# Altium project OBDH_Ed02.PrjPcb
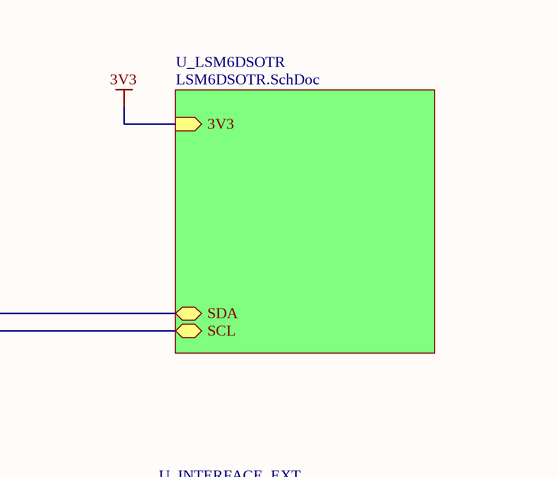
[diagram p0: BLOCO PRINCIPAL.SchDoc, top right]
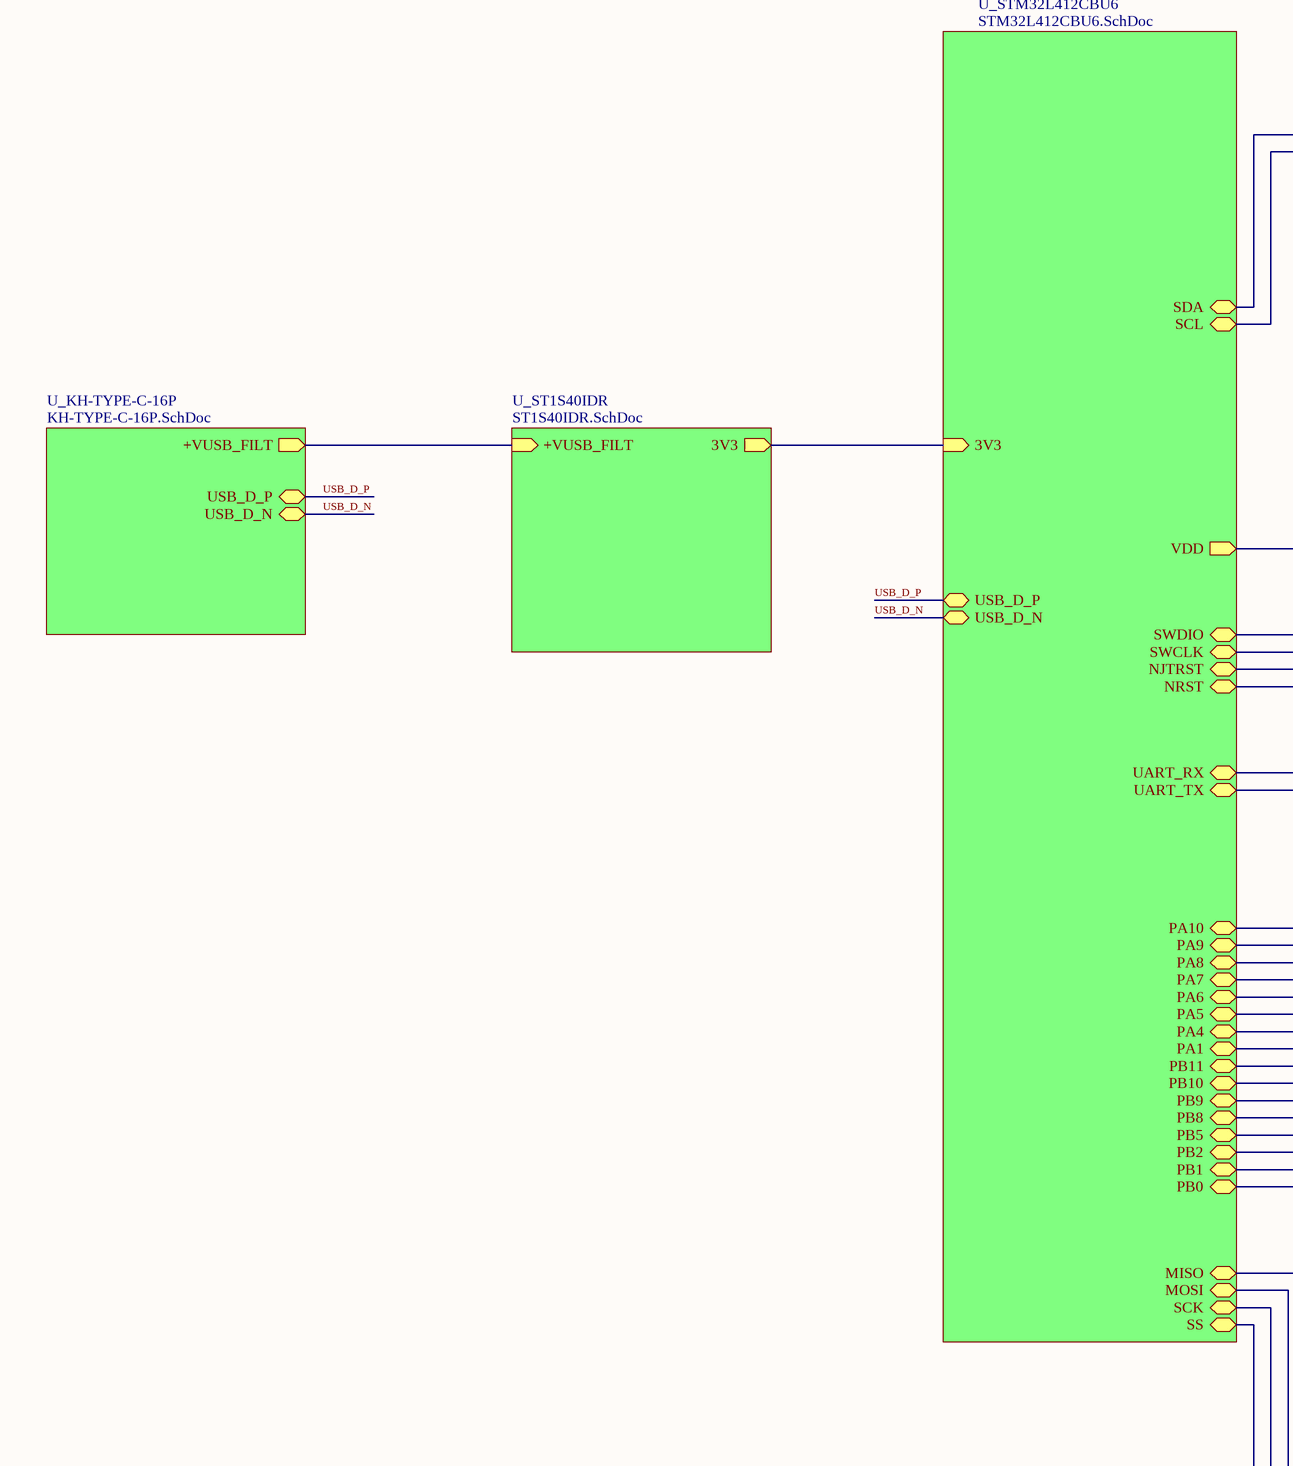
[diagram p1: BLOCO PRINCIPAL.SchDoc, bottom left]
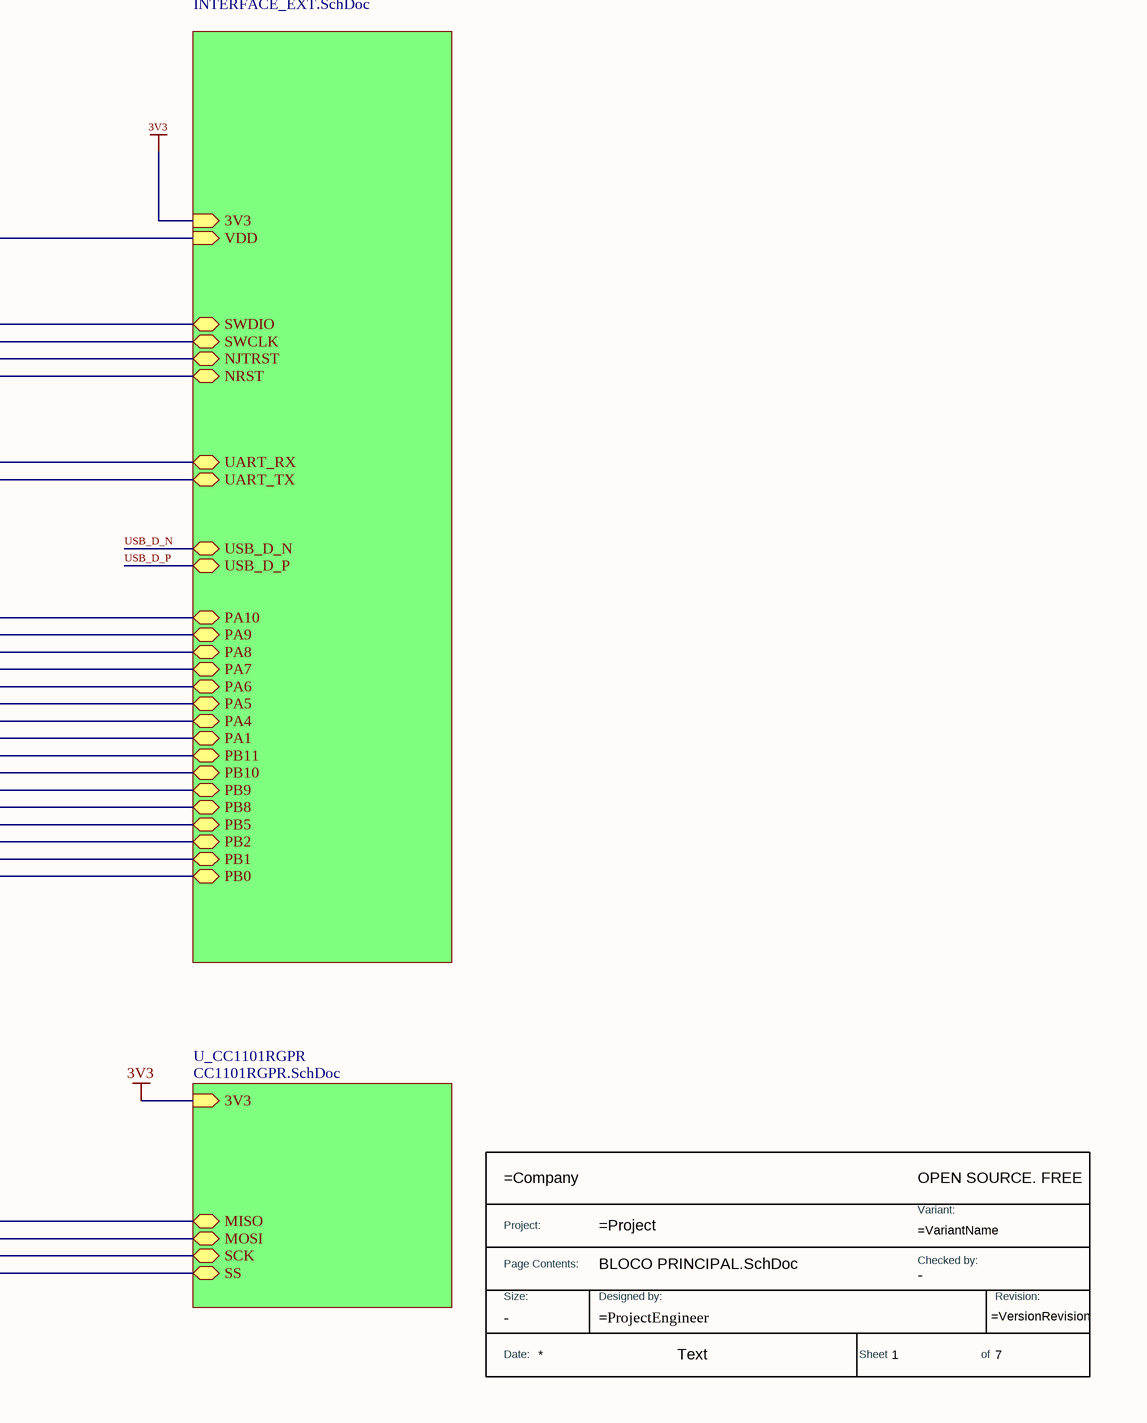
[diagram p2: BLOCO PRINCIPAL.SchDoc, bottom right]
7 sheets, 107 parts. Net scope: hierarchical (ports join the sheet entries above them; power ports are global).
Board file: OBDH_Ed02.PcbDoc
Sheets:
  BLOCO PRINCIPAL.SchDoc
    U_KH-TYPE-C-16P = KH-TYPE-C-16P.SchDoc
    U_STM32L412CBU6 = STM32L412CBU6.SchDoc
    U_ST1S40IDR = ST1S40IDR.SchDoc
    U_CC1101RGPR = CC1101RGPR.SchDoc
    U_LSM6DSOTR = LSM6DSOTR.SchDoc
    U_INTERFACE_EXT = INTERFACE_EXT.SchDoc

## Sheet BLOCO PRINCIPAL.SchDoc
size A3; SheetNumber: 1; SheetTotal: 7

### Parts
(Parts that share a designator on the sheet are numbered #1, #2 ... from top to bottom, then left to right.)
*#1  TitleBlock  (value not drawn)  (graphical)

### Sub-sheets
U_CC1101RGPR = CC1101RGPR.SchDoc: 3V3 (in), MOSI (bidir), MISO (bidir), SCK (bidir), SS (bidir)
U_INTERFACE_EXT = INTERFACE_EXT.SchDoc: SWDIO (bidir), SWCLK (bidir), NJTRST (bidir), USB_D_P (bidir), USB_D_N (bidir), VDD (in), 3V3 (in), UART_RX (bidir), UART_TX (bidir), PA10 (bidir), PA9 (bidir), PA8 (bidir), PA7 (bidir), PA6 (bidir), PA5 (bidir), PA4 (bidir), PA1 (bidir), PB11 (bidir), PB10 (bidir), PB9 (bidir), PB8 (bidir), PB5 (bidir), PB2 (bidir), PB1 (bidir), PB0 (bidir), NRST (bidir)
U_KH-TYPE-C-16P = KH-TYPE-C-16P.SchDoc: USB_D_P (bidir), USB_D_N (bidir), +VUSB_FILT (out)
U_LSM6DSOTR = LSM6DSOTR.SchDoc: SCL (bidir), SDA (bidir), 3V3 (in)
U_ST1S40IDR = ST1S40IDR.SchDoc: 3V3 (out), +VUSB_FILT (in)
U_STM32L412CBU6 = STM32L412CBU6.SchDoc: USB_D_N (bidir), USB_D_P (bidir), 3V3 (in), MOSI (bidir), MISO (bidir), SCK (bidir), SS (bidir), SDA (bidir), SCL (bidir), VDD (out), SWDIO (bidir), SWCLK (bidir), NJTRST (bidir), PA10 (bidir), PA9 (bidir), PA8 (bidir), PA7 (bidir), PA6 (bidir), PA5 (bidir), PA4 (bidir), PA1 (bidir), PB11 (bidir), PB10 (bidir), PB9 (bidir), PB8 (bidir), PB5 (bidir), PB2 (bidir), PB1 (bidir), PB0 (bidir), UART_RX (bidir), UART_TX (bidir), NRST (bidir)

### Nets
3V3: sheet U_STM32L412CBU6/3V3, sheet U_ST1S40IDR/3V3, sheet U_CC1101RGPR/3V3, sheet U_LSM6DSOTR/3V3, sheet U_INTERFACE_EXT/3V3
VDD: sheet U_STM32L412CBU6/VDD, sheet U_INTERFACE_EXT/VDD
VIN: sheet U_KH-TYPE-C-16P/+VUSB_FILT, sheet U_ST1S40IDR/+VUSB_FILT
I2C_SCL: sheet U_STM32L412CBU6/SCL, sheet U_LSM6DSOTR/SCL
I2C_SDA: sheet U_STM32L412CBU6/SDA, sheet U_LSM6DSOTR/SDA
NJTRST: sheet U_STM32L412CBU6/NJTRST, sheet U_INTERFACE_EXT/NJTRST
NRST: sheet U_STM32L412CBU6/NRST, sheet U_INTERFACE_EXT/NRST
PA1: sheet U_STM32L412CBU6/PA1, sheet U_INTERFACE_EXT/PA1
PA4: sheet U_STM32L412CBU6/PA4, sheet U_INTERFACE_EXT/PA4
PA5: sheet U_STM32L412CBU6/PA5, sheet U_INTERFACE_EXT/PA5
PA6: sheet U_STM32L412CBU6/PA6, sheet U_INTERFACE_EXT/PA6
PA7: sheet U_STM32L412CBU6/PA7, sheet U_INTERFACE_EXT/PA7
PA8: sheet U_STM32L412CBU6/PA8, sheet U_INTERFACE_EXT/PA8
PA9: sheet U_STM32L412CBU6/PA9, sheet U_INTERFACE_EXT/PA9
PA10: sheet U_STM32L412CBU6/PA10, sheet U_INTERFACE_EXT/PA10
PB0: sheet U_STM32L412CBU6/PB0, sheet U_INTERFACE_EXT/PB0
PB1: sheet U_STM32L412CBU6/PB1, sheet U_INTERFACE_EXT/PB1
PB2: sheet U_STM32L412CBU6/PB2, sheet U_INTERFACE_EXT/PB2
PB5: sheet U_STM32L412CBU6/PB5, sheet U_INTERFACE_EXT/PB5
PB8: sheet U_STM32L412CBU6/PB8, sheet U_INTERFACE_EXT/PB8
PB9: sheet U_STM32L412CBU6/PB9, sheet U_INTERFACE_EXT/PB9
PB10: sheet U_STM32L412CBU6/PB10, sheet U_INTERFACE_EXT/PB10
PB11: sheet U_STM32L412CBU6/PB11, sheet U_INTERFACE_EXT/PB11
SPI2_MISO: sheet U_STM32L412CBU6/MISO, sheet U_CC1101RGPR/MISO
SPI2_MOSI: sheet U_STM32L412CBU6/MOSI, sheet U_CC1101RGPR/MOSI
SPI2_nSS: sheet U_STM32L412CBU6/SS, sheet U_CC1101RGPR/SS
SPI2_SCK: sheet U_STM32L412CBU6/SCK, sheet U_CC1101RGPR/SCK
SWCLK: sheet U_STM32L412CBU6/SWCLK, sheet U_INTERFACE_EXT/SWCLK
SWDIO: sheet U_STM32L412CBU6/SWDIO, sheet U_INTERFACE_EXT/SWDIO
UART_RX: sheet U_STM32L412CBU6/UART_RX, sheet U_INTERFACE_EXT/UART_RX
UART_TX: sheet U_STM32L412CBU6/UART_TX, sheet U_INTERFACE_EXT/UART_TX
USB_D_N: sheet U_KH-TYPE-C-16P/USB_D_N, sheet U_STM32L412CBU6/USB_D_N, sheet U_INTERFACE_EXT/USB_D_N
USB_D_P: sheet U_KH-TYPE-C-16P/USB_D_P, sheet U_STM32L412CBU6/USB_D_P, sheet U_INTERFACE_EXT/USB_D_P

### Notes on the sheet
- Todas as informações e detalhes técnicos deste documento são de inteira propriedade da empresa V2COM,
- não poderão ser copiados, reduzidos ou cedidos a terceiros sem prévia autorização por escrito da mesma.
- Salvo em (D/M/A):
- Página:
- de
- Nome do Projeto:
- https://v2com.com/
- Ed.:
- Responsável:
- Nome da página:
- Rev.:
- Projetista:
- Obs.:
- Revisor:
- Arquivo:
- -
- (in symbol TitleBlock) OPEN SOURCE. FREE; Project:; Variant:; Page Contents:; Checked by:; Size:; Designed by:; Revision:; Date:; Text; Sheet; of

### Library data of the parts
*#1 = TitleBlock: Standard Title Block; DWG NO: =ProjectEngineer; Size: -; Checked by: -

## Sheet KH-TYPE-C-16P.SchDoc
size A3; SheetNumber: 2; SheetTotal: 7
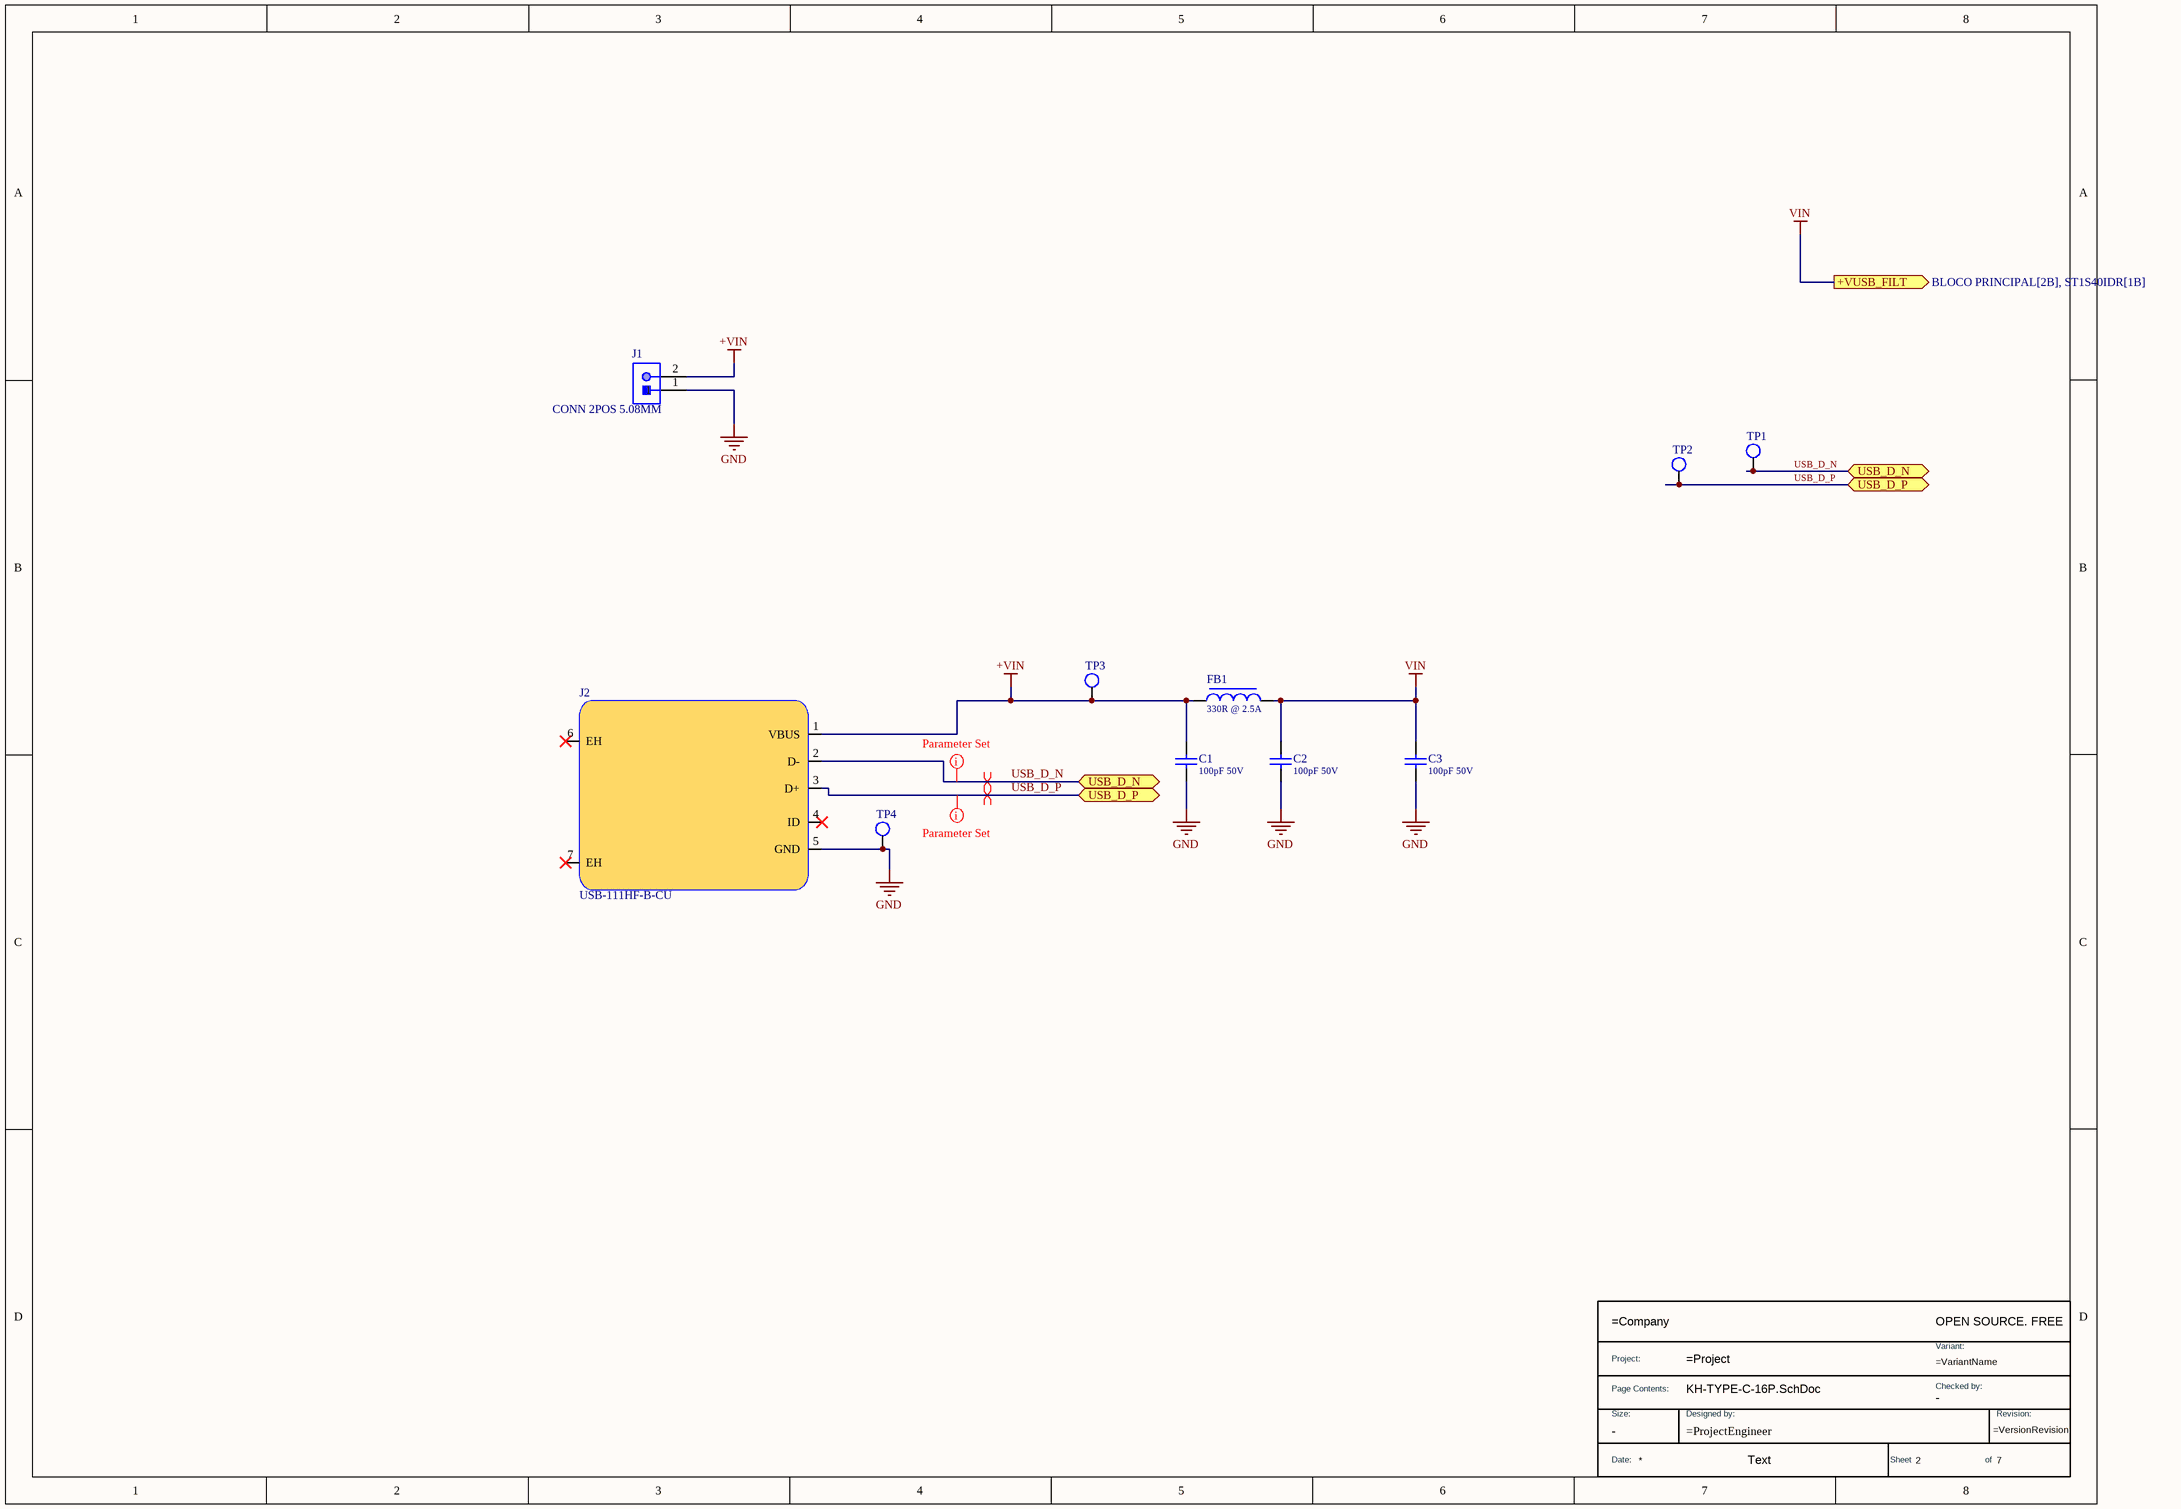
[diagram p3: KH-TYPE-C-16P.SchDoc]

### Parts
(Parts that share a designator on the sheet are numbered #1, #2 ... from top to bottom, then left to right.)
*#2  TitleBlock  (value not drawn)  (graphical)
C1  Valor: 100pF 50V  [CAP_0805]  (hidden comment: CC0805JRNPO9BN101)
C2  Valor: 100pF 50V  [CAP_0805]  (hidden comment: CC0805JRNPO9BN101)
C3  Valor: 100pF 50V  [CAP_0805]  (hidden comment: CC0805JRNPO9BN101)
FB1  Valor: 330R @ 2.5A  [IND_0805]  (hidden comment: MPZ2012S331AT000)
J1  Valor: CONN 2POS 5.08MM  [CONN TERM BLOCK 2POS 5.08MM]  (hidden comment: 796638-2)
J2  USB-111HF-B-CU  [USB-111HF-B-CU]
TP1  TEST_POINT_1.5MM  [TESTPOINT_1.5MM]  (value not drawn)  (no BOM)
TP2  TEST_POINT_1.5MM  [TESTPOINT_1.5MM]  (value not drawn)  (no BOM)
TP3  TEST_POINT_1.5MM  [TESTPOINT_1.5MM]  (value not drawn)  (no BOM)
TP4  TEST_POINT_1.5MM  [TESTPOINT_1.5MM]  (value not drawn)  (no BOM)

### Ports
+VUSB_FILT (out, see BLOCO PRINCIPAL[2B], ST1S40IDR[1B]), USB_D_N (bidir, see BLOCO PRINCIPAL[2B], INTERFACE_EXT[1B], STM32L412CBU6[6B]), USB_D_P (bidir, see BLOCO PRINCIPAL[2B], INTERFACE_EXT[1B], STM32L412CBU6[6B])

### Nets
+VIN: C1.2 FB1.1 J1.2 J2.1(VBUS) TP3.1
GND: C1.1 C2.1 C3.1 J1.1 J2.5(GND) TP4.1
VIN: C2.2 C3.2 FB1.2 ; port +VUSB_FILT
USB_D_N: J2.2(D-) TP1.1 ; port USB_D_N
USB_D_P: J2.3(D+) TP2.1 ; port USB_D_P

Not connected (* = marked no-connect by the designer): J2 4(ID)* 6(EH)* 7(EH)*

### Layout directives
differential pair; differential pair class USB: USB_D_N, USB_D_P
net class USB: USB_D_N, USB_D_P

### Notes on the sheet
- Todas as informações e detalhes técnicos deste documento são de inteira propriedade da empresa V2COM,
- não poderão ser copiados, reduzidos ou cedidos a terceiros sem prévia autorização por escrito da mesma.
- Salvo em (D/M/A):
- Página:
- de
- Nome do Projeto:
- https://v2com.com/
- Ed.:
- Responsável:
- Nome da página:
- Rev.:
- Projetista:
- Obs.:
- Revisor:
- Arquivo:
- -
- (in symbol TitleBlock) OPEN SOURCE. FREE; Project:; Variant:; Page Contents:; Checked by:; Size:; Designed by:; Revision:; Date:; Text; Sheet; of

### Library data of the parts
*#2 = TitleBlock: Standard Title Block; DWG NO: =ProjectEngineer; Size: -; Checked by: -
C1-C3 = CC0805JRNPO9BN101: CAP CER 100PF 50V C0G/NPO 0805; Manufacturer: YAGEO; Origem: OBDH_Ed02; Case/Package: 0805; Manufacturer Part Number: CC0805JRNPO9BN101; Observação: *
FB1 = MPZ2012S331AT000: FERRITE BEAD 330 OHM 0805 1LN; Manufacturer: TDK Corporation; Case/Package: 0805; Manufacturer Part Number: MPZ2012S331AT000; Origem: *; Observação: *
J1 = 796638-2: CONN TERM BLOCK HDR 2POS 90DEG 5.08MM; Manufacturer: TE Connectivity AMP Connectors; Origem: GT1021_Ed04r2; Manufacturer Part Number: 796638-2; Case/Package: PTH; Observação: *
J2 = USB-111HF-B-CU: Female 5 Micro-B Surface Mount SMD USB Connectors ROHS
TP1-TP4 = TEST_POINT_1.5MM: TEST_POINT; Origem: -; Case/Package: SMD; Manufacturer: -; Manufacturer Part Number: TEST_POINT; Observação: *; Valor: *

## Sheet STM32L412CBU6.SchDoc
size A3; SheetNumber: 6; SheetTotal: 7
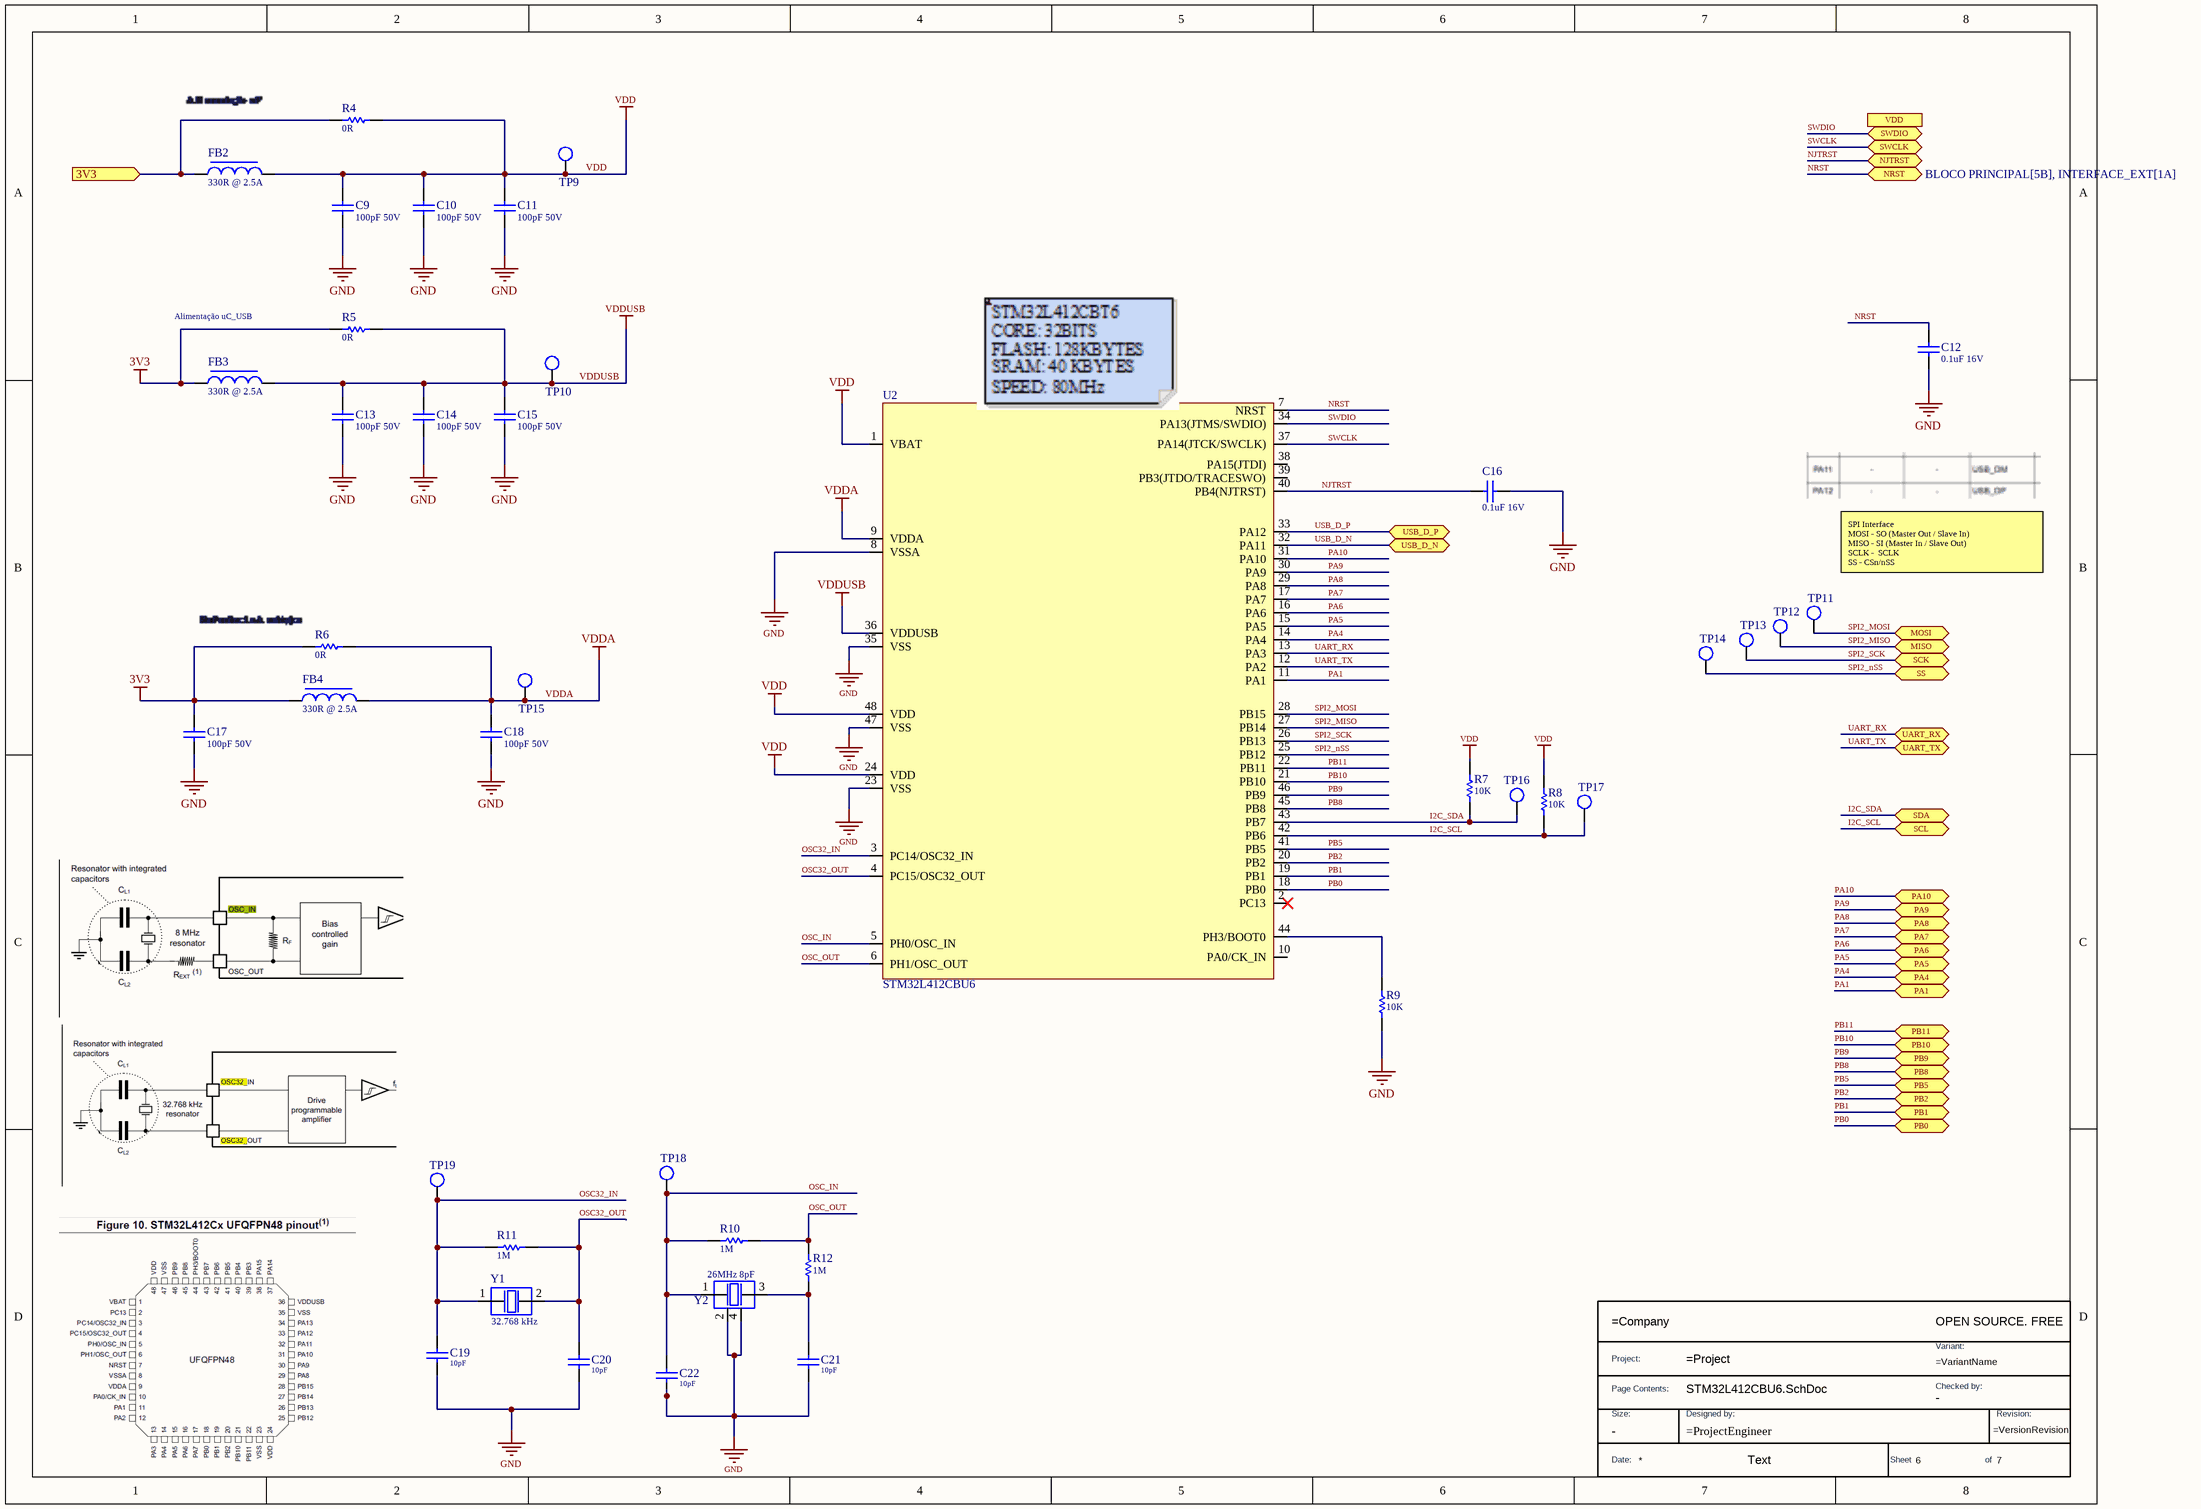
[diagram p4: STM32L412CBU6.SchDoc]

### Parts
(Parts that share a designator on the sheet are numbered #1, #2 ... from top to bottom, then left to right.)
*#3  TitleBlock  (value not drawn)  (graphical)
C9  Valor: 100pF 50V  [CAP_0805]  (hidden comment: CC0805JRNPO9BN101)
C10  Valor: 100pF 50V  [CAP_0805]  (hidden comment: CC0805JRNPO9BN101)
C11  Valor: 100pF 50V  [CAP_0805]  (hidden comment: CC0805JRNPO9BN101)
C12  Valor: 0.1uF 16V  [CAP_0805]  (hidden comment: CL05B104KO5NNNC)
C13  Valor: 100pF 50V  [CAP_0805]  (hidden comment: CC0805JRNPO9BN101)
C14  Valor: 100pF 50V  [CAP_0805]  (hidden comment: CC0805JRNPO9BN101)
C15  Valor: 100pF 50V  [CAP_0805]  (hidden comment: CC0805JRNPO9BN101)
C16  Valor: 0.1uF 16V  [CAP_0805]  (hidden comment: CL05B104KO5NNNC)
C17  Valor: 100pF 50V  [CAP_0805]  (hidden comment: CC0805JRNPO9BN101)
C18  Valor: 100pF 50V  [CAP_0805]  (hidden comment: CC0805JRNPO9BN101)
C19  Valor: 10pF  [CAP 0402]  (hidden comment: GRM1555C1H100FA01D)
C20  Valor: 10pF  [CAP 0402]  (hidden comment: GRM1555C1H100FA01D)
C21  Valor: 10pF  [CAP 0402]  (hidden comment: GRM1555C1H100FA01D)
C22  Valor: 10pF  [CAP 0402]  (hidden comment: GRM1555C1H100FA01D)
FB2  Valor: 330R @ 2.5A  [IND_0805]  (hidden comment: MPZ2012S331AT000)
FB3  Valor: 330R @ 2.5A  [IND_0805]  (hidden comment: MPZ2012S331AT000)
FB4  Valor: 330R @ 2.5A  [IND_0805]  (hidden comment: MPZ2012S331AT000)
R4  Valor: 0R  [RES_0805]  (hidden comment: RC0805JR-070RL)
R5  Valor: 0R  [RES_0805]  (hidden comment: RC0805JR-070RL)
R6  Valor: 0R  [RES_0805]  (hidden comment: RC0805JR-070RL)
R7  Valor: 10K  [RES_0805]  (hidden comment: AF0805JR-0710KL)
R8  Valor: 10K  [RES_0805]  (hidden comment: AF0805JR-0710KL)
R9  Valor: 10K  [RES_0805]  (hidden comment: AF0805JR-0710KL)
R10  Valor: 1M  [RES 0402]  (hidden comment: CRCW08051M00JNEA)
R11  Valor: 1M  [RES 0402]  (hidden comment: CRCW08051M00JNEA)
R12  Valor: 1M  [RES 0402]  (hidden comment: CRCW08051M00JNEA)
TP9  TEST_POINT_1.5MM  [TESTPOINT_1.5MM]  (value not drawn)  (no BOM)
TP10  TEST_POINT_1.5MM  [TESTPOINT_1.5MM]  (value not drawn)  (no BOM)
TP11  TEST_POINT_1.5MM  [TESTPOINT_1.5MM]  (value not drawn)  (no BOM)
TP12  TEST_POINT_1.5MM  [TESTPOINT_1.5MM]  (value not drawn)  (no BOM)
TP13  TEST_POINT_1.5MM  [TESTPOINT_1.5MM]  (value not drawn)  (no BOM)
TP14  TEST_POINT_1.5MM  [TESTPOINT_1.5MM]  (value not drawn)  (no BOM)
TP15  TEST_POINT_1.5MM  [TESTPOINT_1.5MM]  (value not drawn)  (no BOM)
TP16  TEST_POINT_1.5MM  [TESTPOINT_1.5MM]  (value not drawn)  (no BOM)
TP17  TEST_POINT_1.5MM  [TESTPOINT_1.5MM]  (value not drawn)  (no BOM)
TP18  TEST_POINT_1.5MM  [TESTPOINT_1.5MM]  (value not drawn)  (no BOM)
TP19  TEST_POINT_1.5MM  [TESTPOINT_1.5MM]  (value not drawn)  (no BOM)
U2  STM32L412CBU6  [QFN-48]
Y1  Valor: 32.768 kHz  [Crystal_32k]  (hidden comment: ABS07-32.768KHZ-7-T)
Y2  Valor: 26MHz 8pF  [Crystal-4SMD]  (hidden comment: NX3225SA-26MHZ)

### Ports
3V3 (in, see BLOCO PRINCIPAL[4B], CC1101RGPR[1A], INTERFACE_EXT[1B], LSM6DSOTR[1A], ST1S40IDR[8B]), MISO (bidir, see BLOCO PRINCIPAL[5D], CC1101RGPR[1B]), MOSI (bidir, see BLOCO PRINCIPAL[5D], CC1101RGPR[1B]), NJTRST (bidir, see BLOCO PRINCIPAL[5B], INTERFACE_EXT[1A]), NRST (bidir, see BLOCO PRINCIPAL[5B], INTERFACE_EXT[1A]), PA1 (bidir, see BLOCO PRINCIPAL[5C], INTERFACE_EXT[5A]), PA4 (bidir, see BLOCO PRINCIPAL[5C], INTERFACE_EXT[5A]), PA5 (bidir, see BLOCO PRINCIPAL[5C], INTERFACE_EXT[5A]), PA6 (bidir, see BLOCO PRINCIPAL[5C], INTERFACE_EXT[5A]), PA7 (bidir, see BLOCO PRINCIPAL[5C], INTERFACE_EXT[5A]), PA8 (bidir, see BLOCO PRINCIPAL[5C], INTERFACE_EXT[5A]), PA9 (bidir, see BLOCO PRINCIPAL[5C], INTERFACE_EXT[5A]), PA10 (bidir, see BLOCO PRINCIPAL[5C], INTERFACE_EXT[5A]), PB0 (bidir, see BLOCO PRINCIPAL[5C], INTERFACE_EXT[5B]), PB1 (bidir, see BLOCO PRINCIPAL[5C], INTERFACE_EXT[5B]), PB2 (bidir, see BLOCO PRINCIPAL[5C], INTERFACE_EXT[5B]), PB5 (bidir, see BLOCO PRINCIPAL[5C], INTERFACE_EXT[5B]), PB8 (bidir, see BLOCO PRINCIPAL[5C], INTERFACE_EXT[5B]), PB9 (bidir, see BLOCO PRINCIPAL[5C], INTERFACE_EXT[5B]), PB10 (bidir, see BLOCO PRINCIPAL[5C], INTERFACE_EXT[5B]), PB11 (bidir, see BLOCO PRINCIPAL[5C], INTERFACE_EXT[5B]), SCK (bidir, see BLOCO PRINCIPAL[5D], CC1101RGPR[1B]), SCL (bidir, see BLOCO PRINCIPAL[5B], LSM6DSOTR[7A]), SDA (bidir, see BLOCO PRINCIPAL[5B], LSM6DSOTR[7A]), SS (bidir, see BLOCO PRINCIPAL[5D], CC1101RGPR[1B]), SWCLK (bidir, see BLOCO PRINCIPAL[5B], INTERFACE_EXT[1A]), SWDIO (bidir, see BLOCO PRINCIPAL[5B], INTERFACE_EXT[1A]), UART_RX (bidir, see BLOCO PRINCIPAL[5C], INTERFACE_EXT[1B]), UART_TX (bidir, see BLOCO PRINCIPAL[5C], INTERFACE_EXT[1B]), USB_D_N (bidir, see BLOCO PRINCIPAL[4B], INTERFACE_EXT[1B], KH-TYPE-C-16P[5C], KH-TYPE-C-16P[8B]), USB_D_P (bidir, see BLOCO PRINCIPAL[4B], INTERFACE_EXT[1B], KH-TYPE-C-16P[5C], KH-TYPE-C-16P[8B]), VDD (out, see BLOCO PRINCIPAL[5B], INTERFACE_EXT[1A])

### Nets
3V3: C17.2 FB2.1 FB3.1 FB4.1 R4.1 R5.1 R6.1 ; port 3V3
GND: C9.1 C10.1 C11.1 C12.1 C13.1 C14.1 C15.1 C16.2 C17.1 C18.1 C19.1 C20.1 C21.1 C22.1 R9.1 U2.8(VSSA) U2.23(VSS) U2.35(VSS) U2.47(VSS) Y2.2 Y2.4
VDD: C9.2 C10.2 C11.2 FB2.2 R4.2 R7.2 R8.2 TP9.1 U2.1(VBAT) U2.24(VDD) U2.48(VDD) ; port VDD
VDDA: C18.2 FB4.2 R6.2 TP15.1 U2.9(VDDA)
VDDUSB: C13.2 C14.2 C15.2 FB3.2 R5.2 TP10.1 U2.36(VDDUSB)
I2C_SCL: R8.1 TP17.1 U2.42(PB6) ; port SCL
I2C_SDA: R7.1 TP16.1 U2.43(PB7) ; port SDA
NJTRST: C16.1 U2.40(PB4(NJTRST)) ; port NJTRST
NRST: C12.2 U2.7(NRST) ; port NRST
OSC32_IN: C19.2 R11.1 TP19.1 U2.3(PC14/OSC32_IN) Y1.1
OSC32_OUT: C20.2 R11.2 U2.4(PC15/OSC32_OUT) Y1.2
OSC_IN: C22.2 R10.1 TP18.1 U2.5(PH0/OSC_IN) Y2.1
OSC_OUT: R10.2 R12.2 U2.6(PH1/OSC_OUT)
PA1: U2.11(PA1) ; port PA1
PA4: U2.14(PA4) ; port PA4
PA5: U2.15(PA5) ; port PA5
PA6: U2.16(PA6) ; port PA6
PA7: U2.17(PA7) ; port PA7
PA8: U2.29(PA8) ; port PA8
PA9: U2.30(PA9) ; port PA9
PA10: U2.31(PA10) ; port PA10
PB0: U2.18(PB0) ; port PB0
PB1: U2.19(PB1) ; port PB1
PB2: U2.20(PB2) ; port PB2
PB5: U2.41(PB5) ; port PB5
PB8: U2.45(PB8) ; port PB8
PB9: U2.46(PB9) ; port PB9
PB10: U2.21(PB10) ; port PB10
PB11: U2.22(PB11) ; port PB11
SPI2_MISO: TP12.1 U2.27(PB14) ; port MISO
SPI2_MOSI: TP11.1 U2.28(PB15) ; port MOSI
SPI2_nSS: TP14.1 U2.25(PB12) ; port SS
SPI2_SCK: TP13.1 U2.26(PB13) ; port SCK
SWCLK: U2.37(PA14(JTCK/SWCLK)) ; port SWCLK
SWDIO: U2.34(PA13(JTMS/SWDIO)) ; port SWDIO
UART_RX: U2.13(PA3) ; port UART_RX
UART_TX: U2.12(PA2) ; port UART_TX
USB_D_N: U2.32(PA11) ; port USB_D_N
USB_D_P: U2.33(PA12) ; port USB_D_P
NetC21_2: C21.2 R12.1 Y2.3
NetR9_2: R9.2 U2.44(PH3/BOOT0)

Not connected (* = marked no-connect by the designer): U2 2(PC13)* 10(PA0/CK_IN) 38(PA15(JTDI)) 39(PB3(JTDO/TRACESWO))

### Notes on the sheet
- Alimentação uC_USB
- SPI Interface
  MOSI - SO (Master Out / Slave In)
  MISO - SI (Master In / Slave Out)
  SCLK -  SCLK
  SS - CSn/nSS
- Todas as informações e detalhes técnicos deste documento são de inteira propriedade da empresa V2COM,
- não poderão ser copiados, reduzidos ou cedidos a terceiros sem prévia autorização por escrito da mesma.
- Salvo em (D/M/A):
- Página:
- de
- Nome do Projeto:
- https://v2com.com/
- Ed.:
- Responsável:
- Nome da página:
- Rev.:
- Projetista:
- Obs.:
- Revisor:
- Arquivo:
- -
- (in symbol TitleBlock) OPEN SOURCE. FREE; Project:; Variant:; Page Contents:; Checked by:; Size:; Designed by:; Revision:; Date:; Text; Sheet; of

### Library data of the parts
*#3 = TitleBlock: Standard Title Block; DWG NO: =ProjectEngineer; Size: -; Checked by: -
C9-C11 C13-C15 C17 C18 = CC0805JRNPO9BN101: as C1 on sheet KH-TYPE-C-16P; Case/Package: 0805; Manufacturer Part Number: CC0805JRNPO9BN101; Observação: *
C12 C16 = CL05B104KO5NNNC: CAP CER 0.1UF 16V X5R 0805; Manufacturer: Samsung Electro-Mechanics; Origem: OBDH_Ed02; Case/Package: 0805; Manufacturer Part Number: CL05B104KO5NNNC; Observação: *
C19-C22 = GRM1555C1H100FA01D: CAP CER 10PF 50V C0G/NP0 0402; Manufacturer: Murata Electronics; Case/Package: 0402; Manufacturer Part Number: GRM1555C1H100FA01D; Origem: *; Observação: *
FB2-FB4 = MPZ2012S331AT000: as FB1 on sheet KH-TYPE-C-16P; Case/Package: 0805; Manufacturer Part Number: MPZ2012S331AT000; Origem: *; Observação: *
R4-R6 = RC0805JR-070RL: RES 0 OHM JUMPER 1/8W 0805; Manufacturer: YAGEO; Case/Package: 0805; Manufacturer Part Number: RC0805JR-070RL; Origem: *; Observação: *
R7-R9 = AF0805JR-0710KL: RES SMD 10K OHM 5% 1/8W 0805; Manufacturer: YAGEO; Case/Package: 0805; Manufacturer Part Number: AF0805JR-0710KL; Origem: *; Observação: *
R10-R12 = CRCW08051M00JNEA: RES SMD 1M OHM 5% 1/8W 0805; Manufacturer: Vishay Intertech; Case/Package: 0805; Manufacturer Part Number: CRCW08051M00JNEA; Origem: *; Observação: *
TP9-TP19 = TEST_POINT_1.5MM: TEST_POINT; Origem: -; Case/Package: SMD; Manufacturer: -; Manufacturer Part Number: TEST_POINT; Observação: *; Valor: *
U2 = STM32L412CBU6: ARM® Cortex®-M4 STM32L4 Microcontroller IC 32-Bit Single-Core 80MHz 128KB (128K x 8) FLASH 48-LQFP (7x7)
Y1 = ABS07-32.768KHZ-7-T: CRYSTAL 32.7680KHZ 7PF SMD; Manufacturer: Abracon LLC; Manufacturer Part Number: ABS07-32.768KHZ-7-T; Case/Package: 2-SMD; Observação: *
Y2 = NX3225SA-26MHZ: CRYSTAL 26.0000MHZ 10PF SMD; Manufacturer: NDK America, Inc.; Manufacturer Part Number: NX3225SA-26MHZ; Observação: *

## Sheet ST1S40IDR.SchDoc
size A3; SheetNumber: 3; SheetTotal: 7
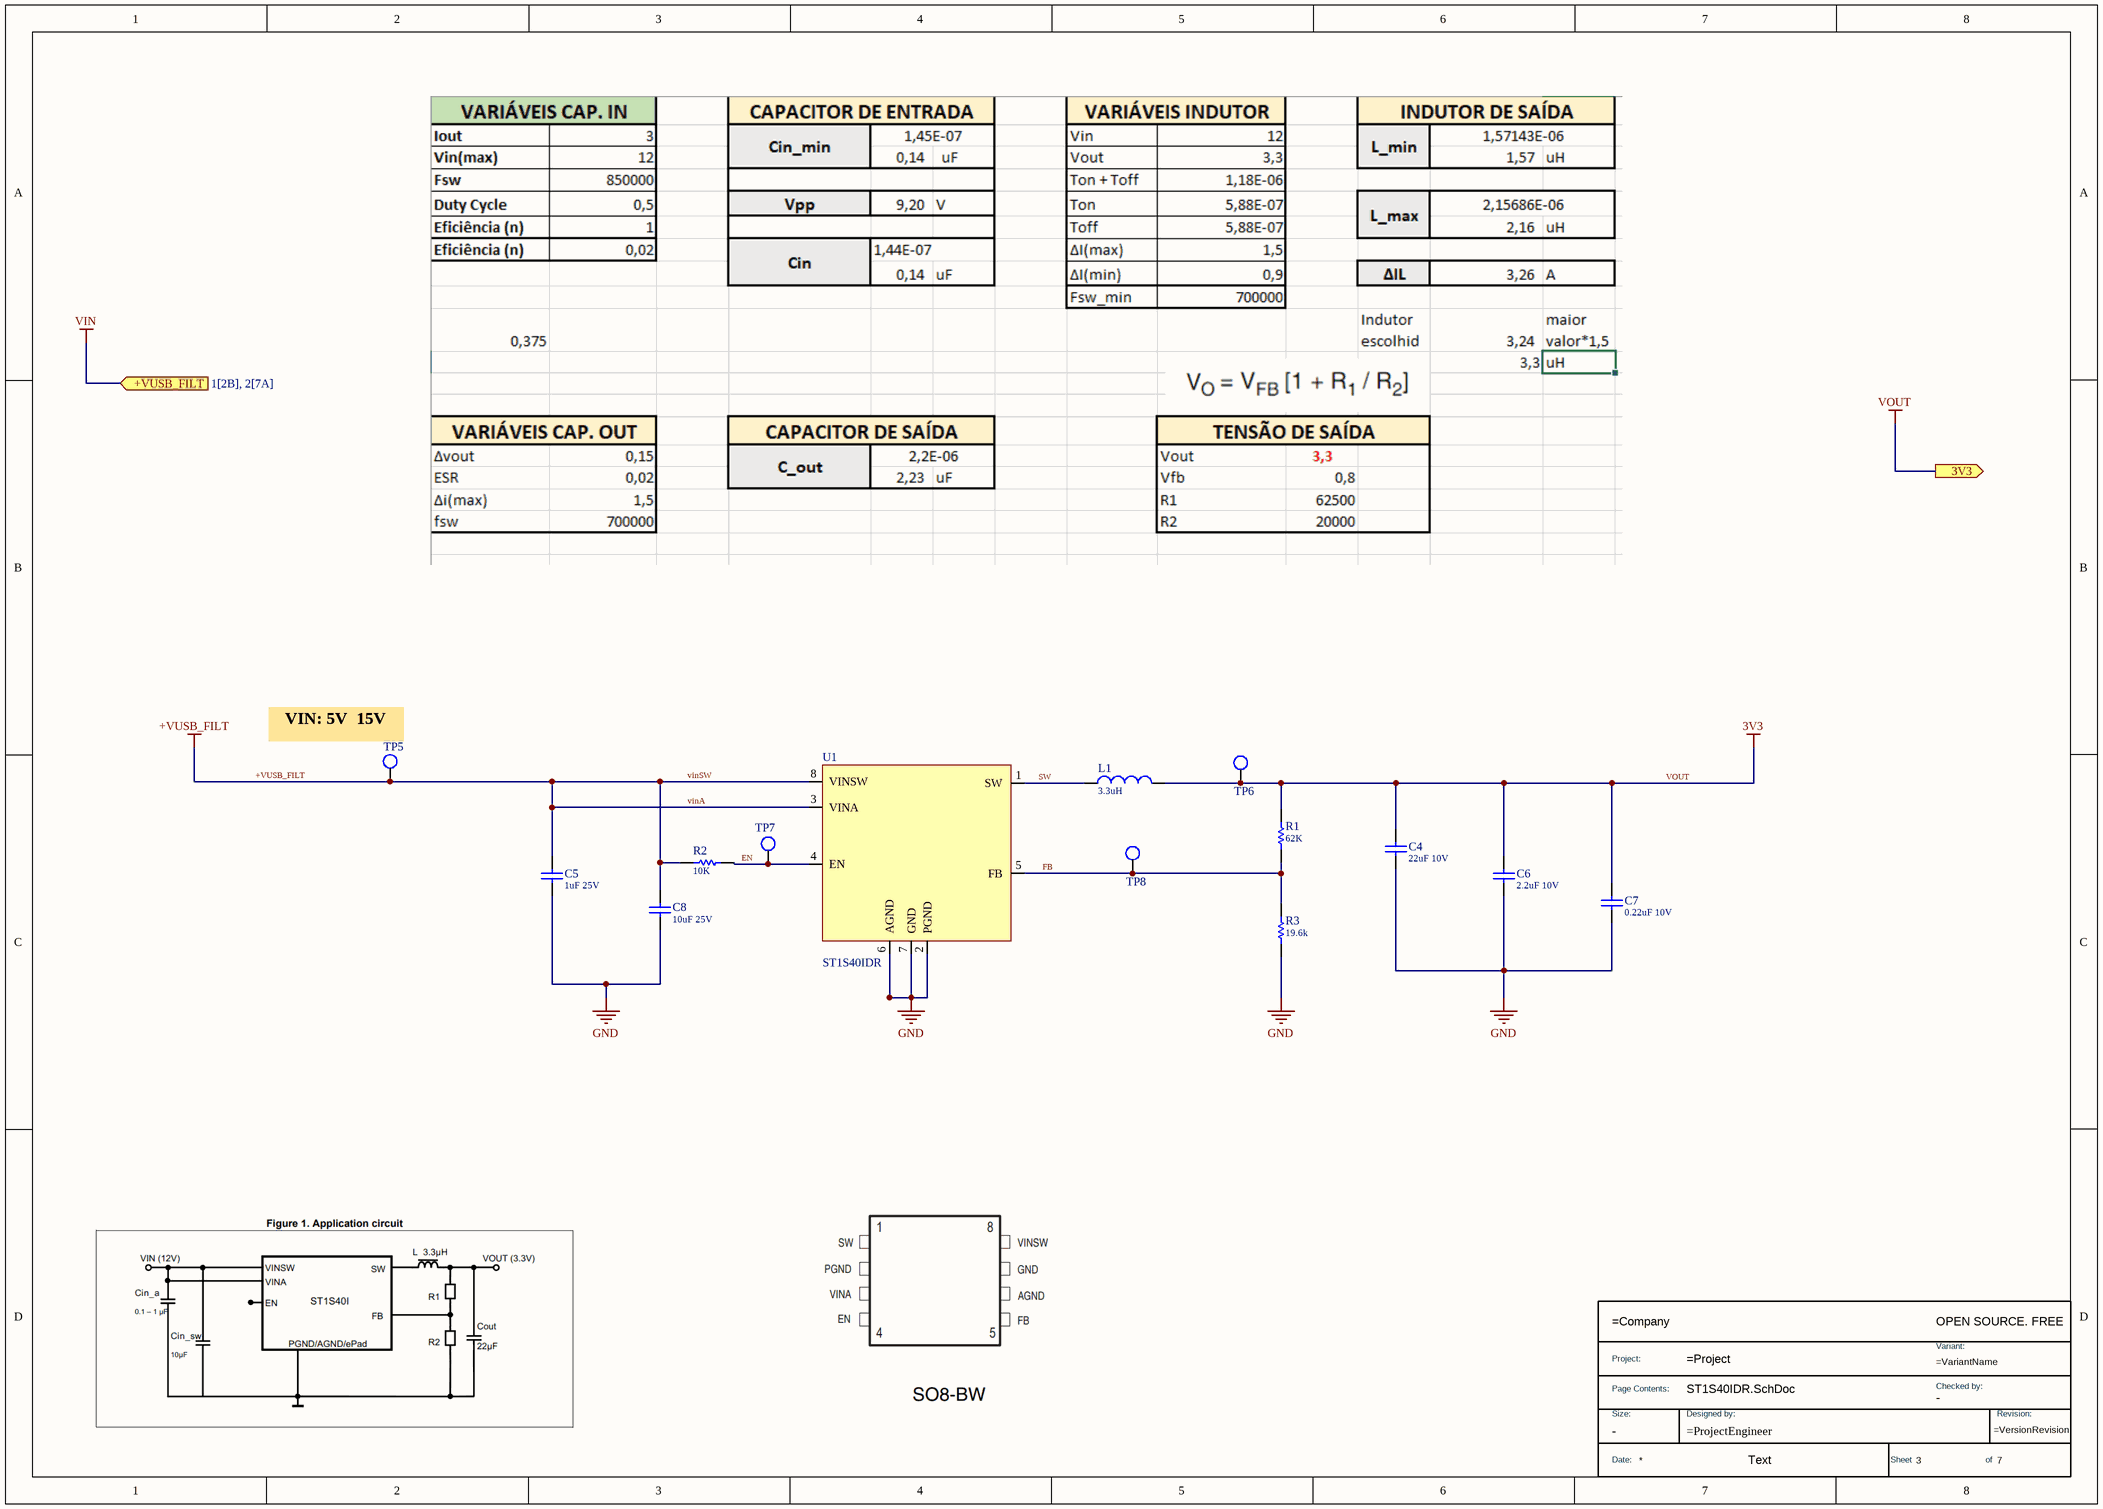
[diagram p5: ST1S40IDR.SchDoc]

### Parts
(Parts that share a designator on the sheet are numbered #1, #2 ... from top to bottom, then left to right.)
*#4  TitleBlock  (value not drawn)  (graphical)
C4  Valor: 22uF 10V  [0805]  (hidden comment: CL21A226MPQNNNE)
C5  Valor: 1uF 25V  [CAP_0805]  (hidden comment: CL21B105KAFNNNE)
C6  Valor: 2.2uF 10V  [0805]  (hidden comment: CL21B225KAFNNNE)
C7  Valor: 0.22uF 10V  [0805]  (hidden comment: CC0805KRX7R6BB224)
C8  Valor: 10uF 25V  [CAP_0805]  (hidden comment: CL21A106KAYNNNE)
L1  value 3.3uH  [IND_6.1-4]  (hidden comment: VLS5045EX-3R3N-H)
R1  Valor: 62K  [RES_0805]  (hidden comment: CRCW080562K0JNEA)
R2  Valor: 10K  [RES_0805]  (hidden comment: AF0805JR-0710KL)
R3  Valor: 19.6k  [RES_0805]  (hidden comment: RT0805BRD0719K6L)
TP5  TEST_POINT_1.5MM  [TESTPOINT_1.5MM]  (value not drawn)  (no BOM)
TP6  TEST_POINT_1.5MM  [TESTPOINT_1.5MM]  (value not drawn)  (no BOM)
TP7  TEST_POINT_1.5MM  [TESTPOINT_1.5MM]  (value not drawn)  (no BOM)
TP8  TEST_POINT_1.5MM  [TESTPOINT_1.5MM]  (value not drawn)  (no BOM)
U1  ST1S40IDR  [SO8-BW]

### Ports
3V3 (out, see 1[3B], 4[1A], 5[1B], 6[1A], 7[1A]), +VUSB_FILT (in, see 1[2B], 2[7A])

### Nets
3V3: C4.2 C6.2 C7.2 L1.2 R1.2 TP6.1 ; port 3V3  [also labelled VOUT]
+VUSB_FILT: C5.2 C8.1 R2.1 TP5.1 U1.3(VINA) U1.8(VINSW)  [also labelled vinA, vinSW]
GND: C4.1 C5.1 C6.1 C7.1 C8.2 R3.1 U1.2(PGND) U1.6(AGND) U1.7(GND)
EN: R2.2 TP7.1 U1.4(EN)
FB: R1.1 R3.2 TP8.1 U1.5(FB)
SW: L1.1 U1.1(SW)

### Notes on the sheet
- (near TP5) VIN: 5V  15V
- Todas as informações e detalhes técnicos deste documento são de inteira propriedade da empresa V2COM,
- não poderão ser copiados, reduzidos ou cedidos a terceiros sem prévia autorização por escrito da mesma.
- Salvo em (D/M/A):
- Página:
- de
- Nome do Projeto:
- https://v2com.com/
- Ed.:
- Responsável:
- Nome da página:
- Rev.:
- Projetista:
- Obs.:
- Revisor:
- Arquivo:
- -
- (in symbol TitleBlock) OPEN SOURCE. FREE; Project:; Variant:; Page Contents:; Checked by:; Size:; Designed by:; Revision:; Date:; Text; Sheet; of

### Library data of the parts
*#4 = TitleBlock: Standard Title Block; DWG NO: =ProjectEngineer; Size: -; Checked by: -
C4 = CL21A226MPQNNNE: CAP CER 22UF 10V X5R 0805; Manufacturer: Samsung Electro-Mechanics; Origem: OBDH_Ed02; Case/Package: 0805; Manufacturer Part Number: CL21A226MPQNNNE; Observação: *
C5 = CL21B105KAFNNNE: CAP CER 1UF 25V X7R 0805; Manufacturer: Samsung Electro-Mechanics; Origem: OBDH_Ed02; Case/Package: 0805; Manufacturer Part Number: CL21B105KAFNNNE; Observação: *
C6 = CL21B225KAFNNNE: CAP CER 2.2UF 10V X5R 0805; Manufacturer: Samsung Electro-Mechanics; Origem: OBDH_Ed02; Case/Package: 0805; Manufacturer Part Number: CL21B225KAFNNNE; Observação: *
C7 = CC0805KRX7R6BB224: CAP CER 0.22uF 10V X5R 0805; Manufacturer: YAGEO; Origem: OBDH_Ed02; Case/Package: 0805; Manufacturer Part Number: CC0805KRX7R6BB224; Observação: *
C8 = CL21A106KAYNNNE: CAP CER 10UF 25V X5R 0805; Manufacturer: Samsung Electro-Mechanics; Origem: OBDH_Ed02; Case/Package: 0805; Manufacturer Part Number: CL21A106KAYNNNE; Observação: *
L1 = VLS5045EX-3R3N-H: FIXED IND 3.3UH 4.2A 35.1MOHM SM; Case/Package: *; Manufacturer: *; Manufacturer Part Number: VLS5045EX-3R3N-H; Origem: *; Observação: *
R1 = CRCW080562K0JNEA: RES SMD 62K OHM 5% 1/8W 0805; Manufacturer: YAGEO; Case/Package: 0805; Manufacturer Part Number: CRCW080562K0JNEA; Origem: *; Observação: *
R2 = AF0805JR-0710KL: as R7 on sheet STM32L412CBU6; Case/Package: 0805; Manufacturer Part Number: AF0805JR-0710KL; Origem: *; Observação: *
R3 = RT0805BRD0719K6L: RES SMD 19.6K OHM 5% 1/8W 0805; Manufacturer: YAGEO; Case/Package: 0805; Manufacturer Part Number: RT0805BRD0719K6L; Origem: *; Observação: *
TP5-TP8 = TEST_POINT_1.5MM: TEST_POINT; Origem: -; Case/Package: SMD; Manufacturer: -; Manufacturer Part Number: TEST_POINT; Observação: *; Valor: *
U1 = ST1S40IDR: IC REG BUCK ADJUSTABLE 3A 8SO; Case/Package: *; Manufacturer: *; Manufacturer Part Number: *; Origem: *; Observação: *; Valor: *

## Sheet CC1101RGPR.SchDoc
size A3; SheetNumber: 7; SheetTotal: 7
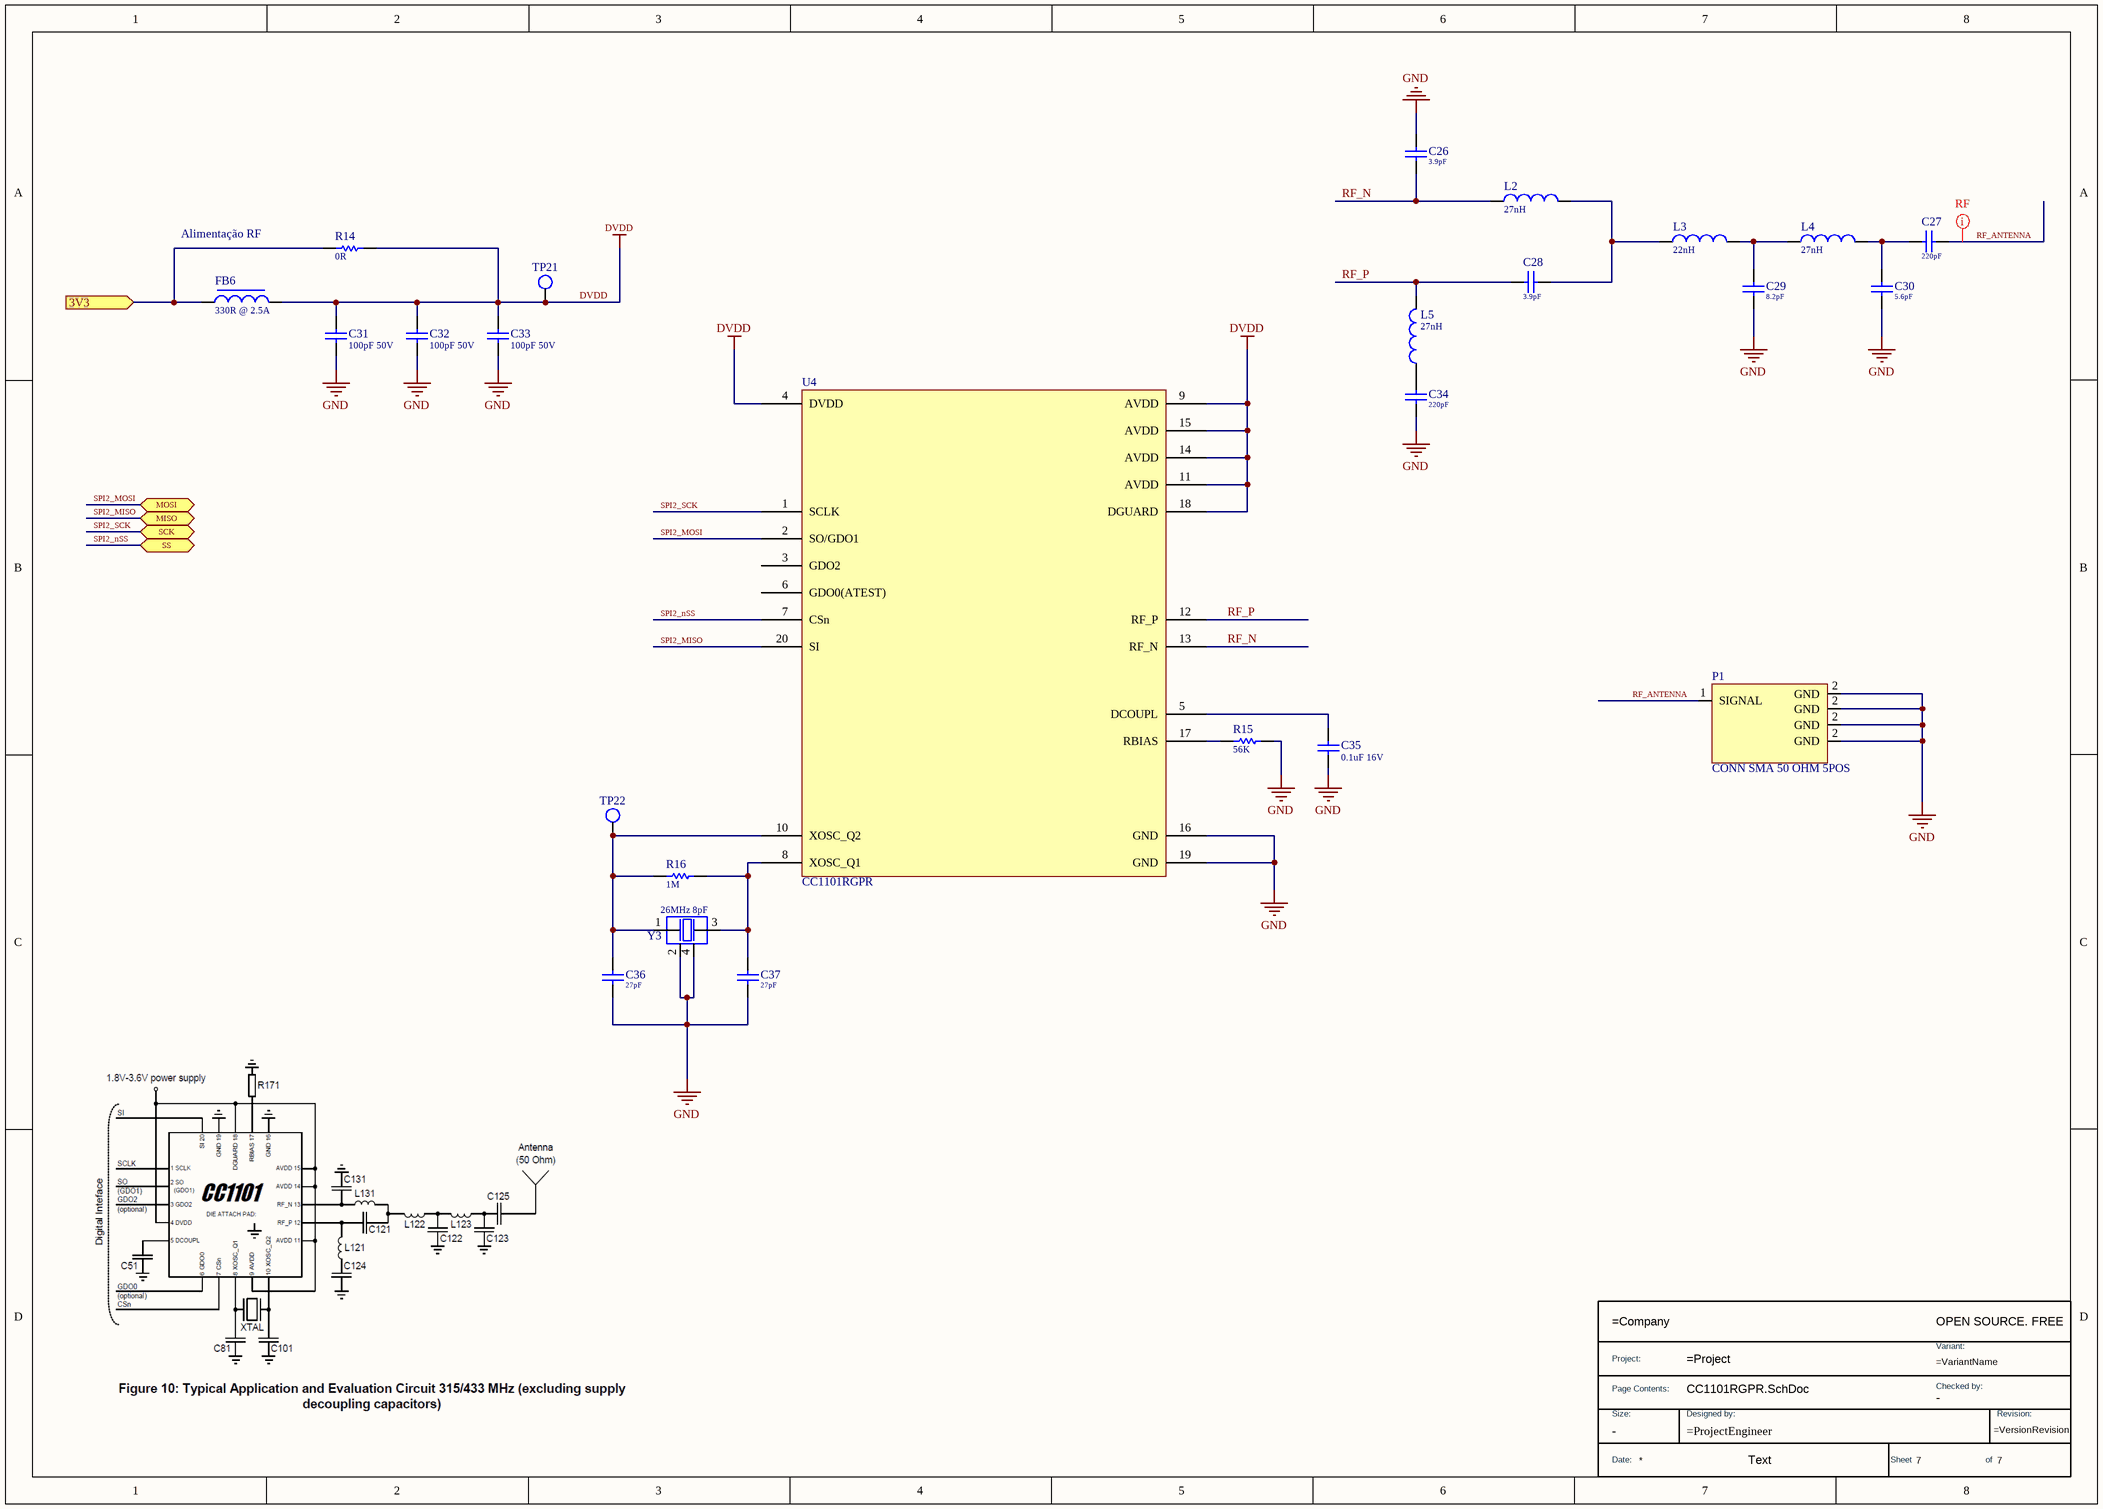
[diagram p6: CC1101RGPR.SchDoc]

### Parts
(Parts that share a designator on the sheet are numbered #1, #2 ... from top to bottom, then left to right.)
*#5  TitleBlock  (value not drawn)  (graphical)
C26  Valor: 3.9pF  [CAP 0402]  (hidden comment: GJM1555C1H3R9WB01D)
C27  Valor: 220pF  [CAP 0402]  (hidden comment: GRM155R71H221JA01D)
C28  Valor: 3.9pF  [CAP 0402]  (hidden comment: GJM1555C1H3R9WB01D)
C29  Valor: 8.2pF  [CAP 0402]  (hidden comment: GCM1555C1H8R2CA16D)
C30  Valor: 5.6pF  [CAP 0402]  (hidden comment: GRM1555C1H5R6CA01D)
C31  Valor: 100pF 50V  [CAP_0805]  (hidden comment: CC0805JRNPO9BN101)
C32  Valor: 100pF 50V  [CAP_0805]  (hidden comment: CC0805JRNPO9BN101)
C33  Valor: 100pF 50V  [CAP_0805]  (hidden comment: CC0805JRNPO9BN101)
C34  Valor: 220pF  [CAP 0402]  (hidden comment: GRM155R71H221JA01D)
C35  Valor: 0.1uF 16V  [CAP_0805]  (hidden comment: CL05B104KO5NNNC)
C36  Valor: 27pF  [CAP 0402]  (hidden comment: GCM1555C1H270JA16D)
C37  Valor: 27pF  [CAP 0402]  (hidden comment: GCM1555C1H270JA16D)
FB6  Valor: 330R @ 2.5A  [IND_0805]  (hidden comment: MPZ2012S331AT000)
L2  value 27nH  [IND 0402]  (hidden comment: LQG15HS27NH02D)
L3  value 22nH  [IND 0402]  (hidden comment: LQG15HN22NH02D)
L4  value 27nH  [IND 0402]  (hidden comment: LQG15HS27NH02D)
L5  value 27nH  [IND 0402]  (hidden comment: LQG15HS27NH02D)
P1  CONN SMA 50 OHM 5POS  [CONN PTH SMA JACK CONSMA002-L-G]
R14  Valor: 0R  [RES_0805]  (hidden comment: RC0805JR-070RL)
R15  Valor: 56K  [RES_0805]  (hidden comment: **CRCW080562K0JNEA)
R16  Valor: 1M  [RES 0402]  (hidden comment: CRCW08051M00JNEA)
TP21  TEST_POINT_1.5MM  [TESTPOINT_1.5MM]  (value not drawn)  (no BOM)
TP22  TEST_POINT_1.5MM  [TESTPOINT_1.5MM]  (value not drawn)  (no BOM)
U4  CC1101RGPR  [QLP-4x4]
Y3  Valor: 26MHz 8pF  [Crystal-4SMD]  (hidden comment: NX3225SA-26MHZ)

### Ports
3V3 (in, see 1[6D], 3[8B], 4[1A], 5[1B], 6[1A]), MISO (bidir, see 1[6D], 6[8B]), MOSI (bidir, see 1[6D], 6[8B]), SCK (bidir, see 1[6D], 6[8B]), SS (bidir, see 1[6D], 6[8B])

### Nets
3V3: FB6.1 R14.1 ; port 3V3
DVDD: C31.2 C32.2 C33.2 FB6.2 R14.2 TP21.1 U4.4(DVDD) U4.9(AVDD) U4.11(AVDD) U4.14(AVDD) U4.15(AVDD) U4.18(DGUARD)
GND: C26.2 C29.2 C30.1 C31.1 C32.1 C33.1 C34.1 C35.1 C36.1 C37.1 P1.2(GND) R15.2 U4.16(GND) U4.19(GND) Y3.2 Y3.4
RF_ANTENNA: C27.2 P1.1(SIGNAL)
RF_N: C26.1 L2.1 U4.13(RF_N)
RF_P: C28.1 L5.2 U4.12(RF_P)
SPI2_MISO: U4.20(SI) ; port MISO
SPI2_MOSI: U4.2(SO/GDO1) ; port MOSI
SPI2_nSS: U4.7(CSn) ; port SS
SPI2_SCK: U4.1(SCLK) ; port SCK
NetC27_1: C27.1 C30.2 L4.2
NetC28_2: C28.2 L2.2 L3.1
NetC29_1: C29.1 L3.2 L4.1
NetC34_2: C34.2 L5.1
NetC35_2: C35.2 U4.5(DCOUPL)
NetC36_2: C36.2 R16.1 TP22.1 U4.10(XOSC_Q2) Y3.1
NetC37_2: C37.2 R16.2 U4.8(XOSC_Q1) Y3.3
NetR15_1: R15.1 U4.17(RBIAS)

Not connected (* = marked no-connect by the designer): U4 3(GDO2) 6(GDO0(ATEST))

### Layout directives
net class RF: RF_ANTENNA

### Notes on the sheet
- Alimentação RF
- Todas as informações e detalhes técnicos deste documento são de inteira propriedade da empresa V2COM,
- não poderão ser copiados, reduzidos ou cedidos a terceiros sem prévia autorização por escrito da mesma.
- Salvo em (D/M/A):
- Página:
- de
- Nome do Projeto:
- https://v2com.com/
- Ed.:
- Responsável:
- Nome da página:
- Rev.:
- Projetista:
- Obs.:
- Revisor:
- Arquivo:
- -
- (in symbol TitleBlock) OPEN SOURCE. FREE; Project:; Variant:; Page Contents:; Checked by:; Size:; Designed by:; Revision:; Date:; Text; Sheet; of

### Library data of the parts
*#5 = TitleBlock: Standard Title Block; DWG NO: =ProjectEngineer; Size: -; Checked by: -
C26 C28 = GJM1555C1H3R9WB01D: CAP CER 3.9PF 50V C0G/NP0 0402; Manufacturer: Murata Electronics; Case/Package: 0402; Manufacturer Part Number: GJM1555C1H3R9WB01D; Origem: *; Observação: *
C27 C34 = GRM155R71H221JA01D: CAP CER 220PF 50V X7R 0402; Manufacturer: Murata Electronics; Case/Package: 0402; Manufacturer Part Number: GRM155R71H221JA01D; Origem: *; Observação: *
C29 = GCM1555C1H8R2CA16D: CAP CER 8.2PF 50V C0G/NP0 0402; Manufacturer: Murata Electronics; Case/Package: 0402; Manufacturer Part Number: GCM1555C1H8R2CA16D; Origem: *; Observação: *
C30 = GRM1555C1H5R6CA01D: CAP CER 5.6PF 50V C0G/NP0 0402; Manufacturer: Murata Electronics; Case/Package: 0402; Manufacturer Part Number: GRM1555C1H5R6CA01D; Origem: *; Observação: *
C31-C33 = CC0805JRNPO9BN101: as C1 on sheet KH-TYPE-C-16P; Case/Package: 0805; Manufacturer Part Number: CC0805JRNPO9BN101; Observação: *
C35 = CL05B104KO5NNNC: as C12 on sheet STM32L412CBU6; Case/Package: 0805; Manufacturer Part Number: CL05B104KO5NNNC; Observação: *
C36 C37 = GCM1555C1H270JA16D: CAP CER 27PF 50V C0G/NP0 0402; Manufacturer: Murata Electronics; Case/Package: 0402; Manufacturer Part Number: GCM1555C1H270JA16D; Origem: *; Observação: *
FB6 = MPZ2012S331AT000: as FB1 on sheet KH-TYPE-C-16P; Case/Package: 0805; Manufacturer Part Number: MPZ2012S331AT000; Origem: *; Observação: *
L2 L4 L5 = LQG15HS27NH02D: FIXED IND 27NH 350MA 460MOHM SMD; Manufacturer: Murata Electronics; Case/Package: 0402; Manufacturer Part Number: LQG15HS27NH02D; Origem: *; Observação: *
L3 = LQG15HN22NH02D: FIXED IND 22NH 350MA 580MOHM SMD; Manufacturer: Murata Electronics; Case/Package: 0402; Manufacturer Part Number: LQG15HN22NH02D; Origem: *; Observação: *
P1 = CONN SMA 50 OHM 5POS: CONN SMA JACK R/A 50OHM PCB
R14 = RC0805JR-070RL: as R4 on sheet STM32L412CBU6; Case/Package: 0805; Manufacturer Part Number: RC0805JR-070RL; Origem: *; Observação: *
R15 = **CRCW080562K0JNEA: RES SMD 56K OHM 5% 1/8W 0805; Manufacturer: YAGEO; Case/Package: 0805; Manufacturer Part Number: CRCW080562K0JNEA; Origem: *; Observação: *
R16 = CRCW08051M00JNEA: as R10 on sheet STM32L412CBU6; Case/Package: 0805; Manufacturer Part Number: CRCW08051M00JNEA; Origem: *; Observação: *
TP21 TP22 = TEST_POINT_1.5MM: TEST_POINT; Origem: -; Case/Package: SMD; Manufacturer: -; Manufacturer Part Number: TEST_POINT; Observação: *; Valor: *
U4 = CC1101RGPR: IC RF TXRX ISM<1GHZ 20VFQFN; Case/Package: *; Manufacturer: *; Manufacturer Part Number: *; Origem: *; Observação: *; Valor: *; ComponentLink1Description: 3d; ComponentLink1URL: https://www.digikey.com/en/models/4090780
Y3 = NX3225SA-26MHZ: as Y2 on sheet STM32L412CBU6; Manufacturer Part Number: NX3225SA-26MHZ; Observação: *

## Sheet LSM6DSOTR.SchDoc
size A3; SheetNumber: 4; SheetTotal: 7
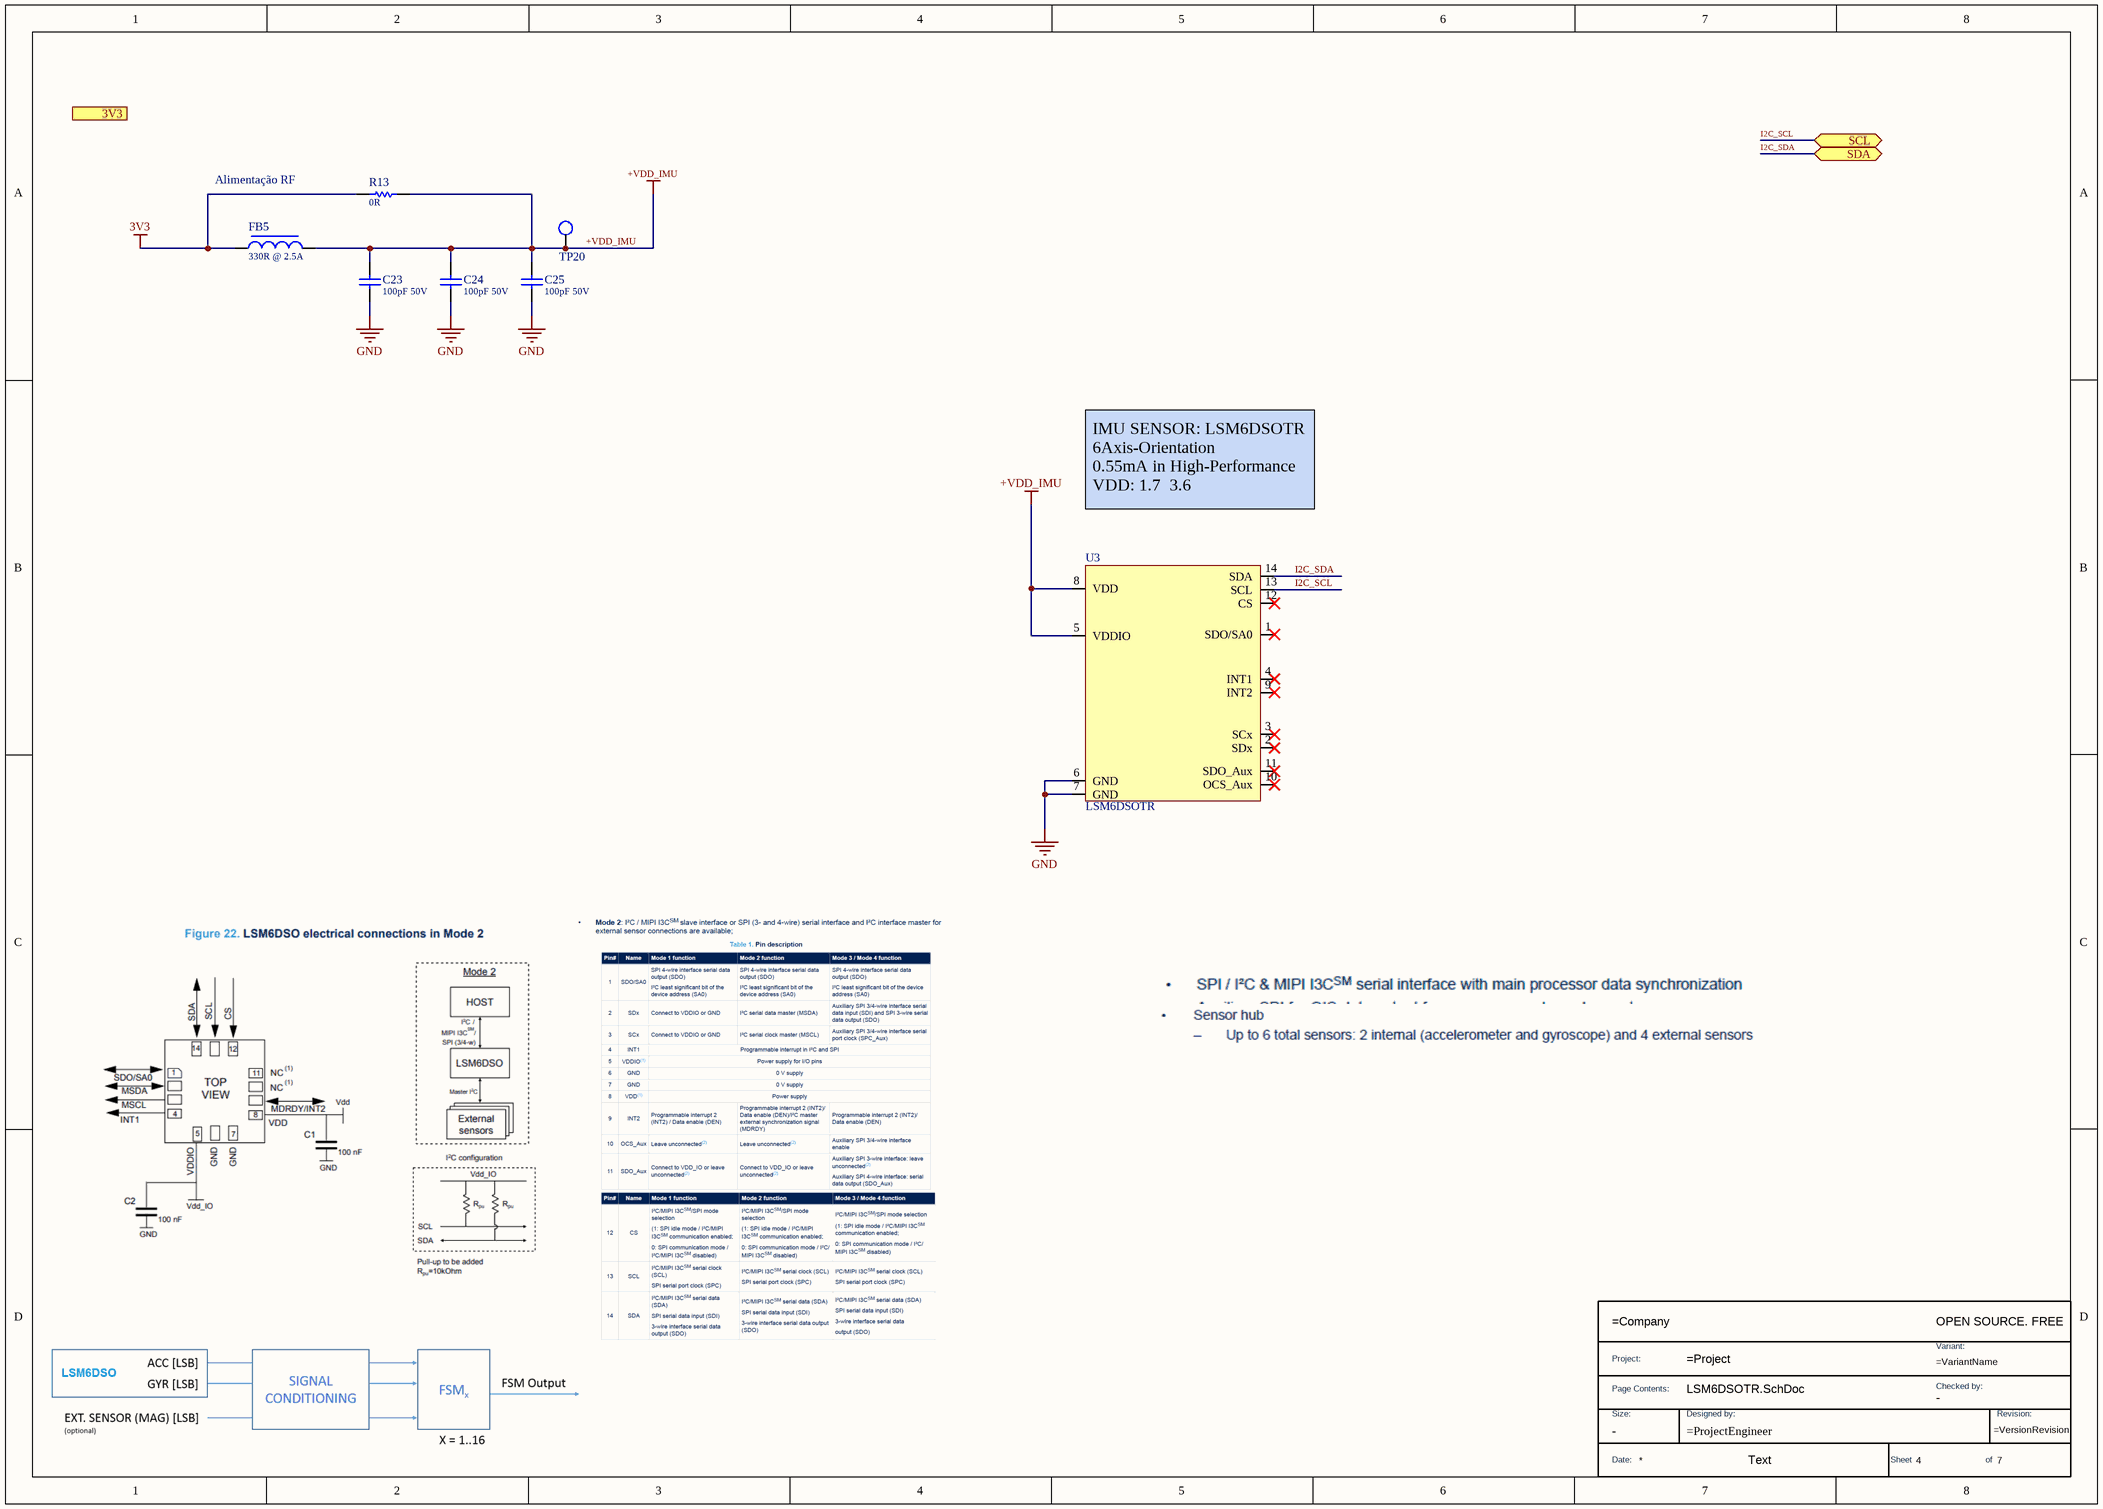
[diagram p7: LSM6DSOTR.SchDoc]

### Parts
(Parts that share a designator on the sheet are numbered #1, #2 ... from top to bottom, then left to right.)
*#6  TitleBlock  (value not drawn)  (graphical)
C23  Valor: 100pF 50V  [CAP_0805]  (hidden comment: CC0805JRNPO9BN101)
C24  Valor: 100pF 50V  [CAP_0805]  (hidden comment: CC0805JRNPO9BN101)
C25  Valor: 100pF 50V  [CAP_0805]  (hidden comment: CC0805JRNPO9BN101)
FB5  Valor: 330R @ 2.5A  [IND_0805]  (hidden comment: MPZ2012S331AT000)
R13  Valor: 0R  [RES_0805]  (hidden comment: RC0805JR-070RL)
TP20  TEST_POINT_1.5MM  [TESTPOINT_1.5MM]  (value not drawn)  (no BOM)
U3  LSM6DSOTR  [IC_IIM-42351]

### Ports
3V3 (in, see 1[6A], 3[8B], 5[1B], 6[1A], 7[1A]), SCL (bidir, see 1[6A], 6[8C]), SDA (bidir, see 1[6A], 6[8C])

### Nets
3V3: FB5.1 R13.1 ; port 3V3
+VDD_IMU: C23.2 C24.2 C25.2 FB5.2 R13.2 TP20.1 U3.5(VDDIO) U3.8(VDD)
GND: C23.1 C24.1 C25.1 U3.6(GND) U3.7(GND)
I2C_SCL: U3.13(SCL) ; port SCL
I2C_SDA: U3.14(SDA) ; port SDA

Not connected (* = marked no-connect by the designer): U3 1(SDO/SA0)* 2(SDx)* 3(SCx)* 4(INT1)* 9(INT2)* 10(OCS_Aux)* 11(SDO_Aux)* 12(CS)*

### Notes on the sheet
- Alimentação RF
- IMU SENSOR: LSM6DSOTR
  6Axis-Orientation
  0.55mA in High-Performance
  VDD: 1.7  3.6
- Todas as informações e detalhes técnicos deste documento são de inteira propriedade da empresa V2COM,
- não poderão ser copiados, reduzidos ou cedidos a terceiros sem prévia autorização por escrito da mesma.
- Salvo em (D/M/A):
- Página:
- de
- Nome do Projeto:
- https://v2com.com/
- Ed.:
- Responsável:
- Nome da página:
- Rev.:
- Projetista:
- Obs.:
- Revisor:
- Arquivo:
- -
- (in symbol TitleBlock) OPEN SOURCE. FREE; Project:; Variant:; Page Contents:; Checked by:; Size:; Designed by:; Revision:; Date:; Text; Sheet; of

### Library data of the parts
*#6 = TitleBlock: Standard Title Block; DWG NO: =ProjectEngineer; Size: -; Checked by: -
C23-C25 = CC0805JRNPO9BN101: as C1 on sheet KH-TYPE-C-16P; Case/Package: 0805; Manufacturer Part Number: CC0805JRNPO9BN101; Observação: *
FB5 = MPZ2012S331AT000: as FB1 on sheet KH-TYPE-C-16P; Case/Package: 0805; Manufacturer Part Number: MPZ2012S331AT000; Origem: *; Observação: *
R13 = RC0805JR-070RL: as R4 on sheet STM32L412CBU6; Case/Package: 0805; Manufacturer Part Number: RC0805JR-070RL; Origem: *; Observação: *
TP20 = TEST_POINT_1.5MM: TEST_POINT; Origem: -; Case/Package: SMD; Manufacturer: -; Manufacturer Part Number: TEST_POINT; Observação: *; Valor: *
U3 = LSM6DSOTR: Accelerometer, Gyroscope, 6 Axis Sensor I²C, SPI Output

## Sheet INTERFACE_EXT.SchDoc
size A3; SheetNumber: 5; SheetTotal: 7
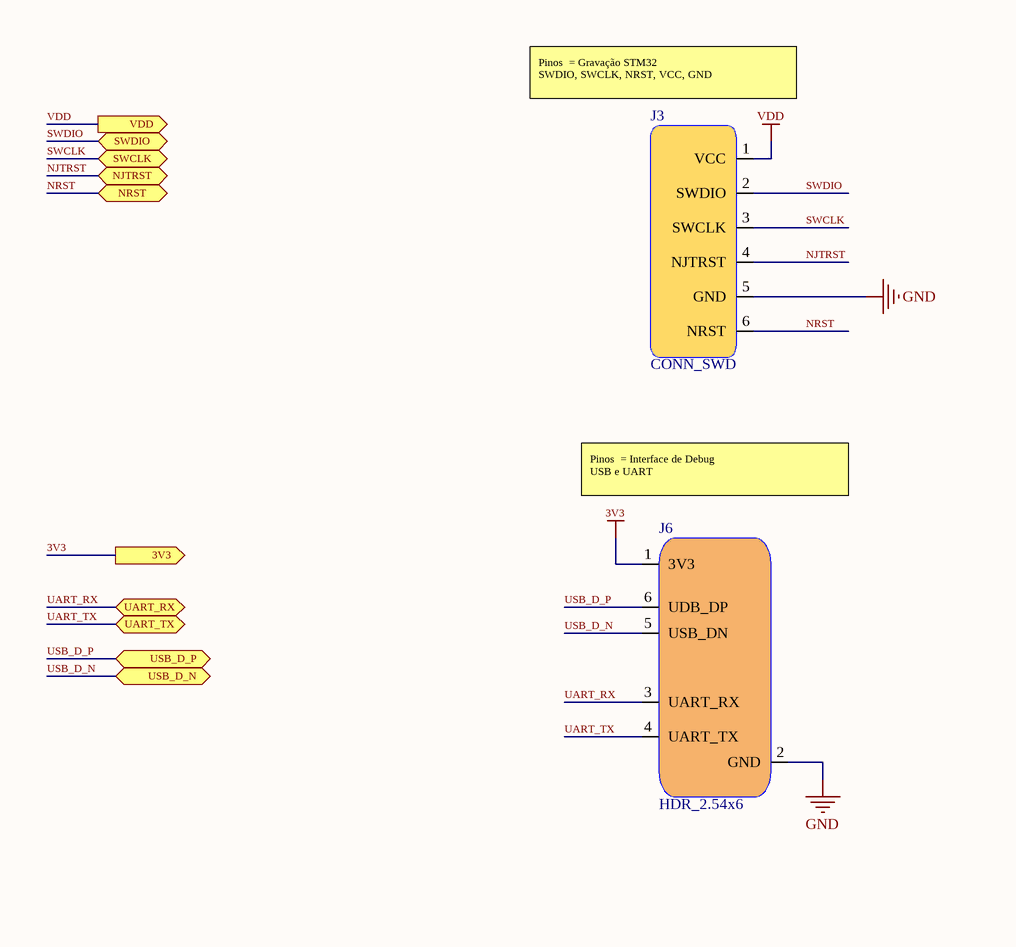
[diagram p8: INTERFACE_EXT.SchDoc, left]
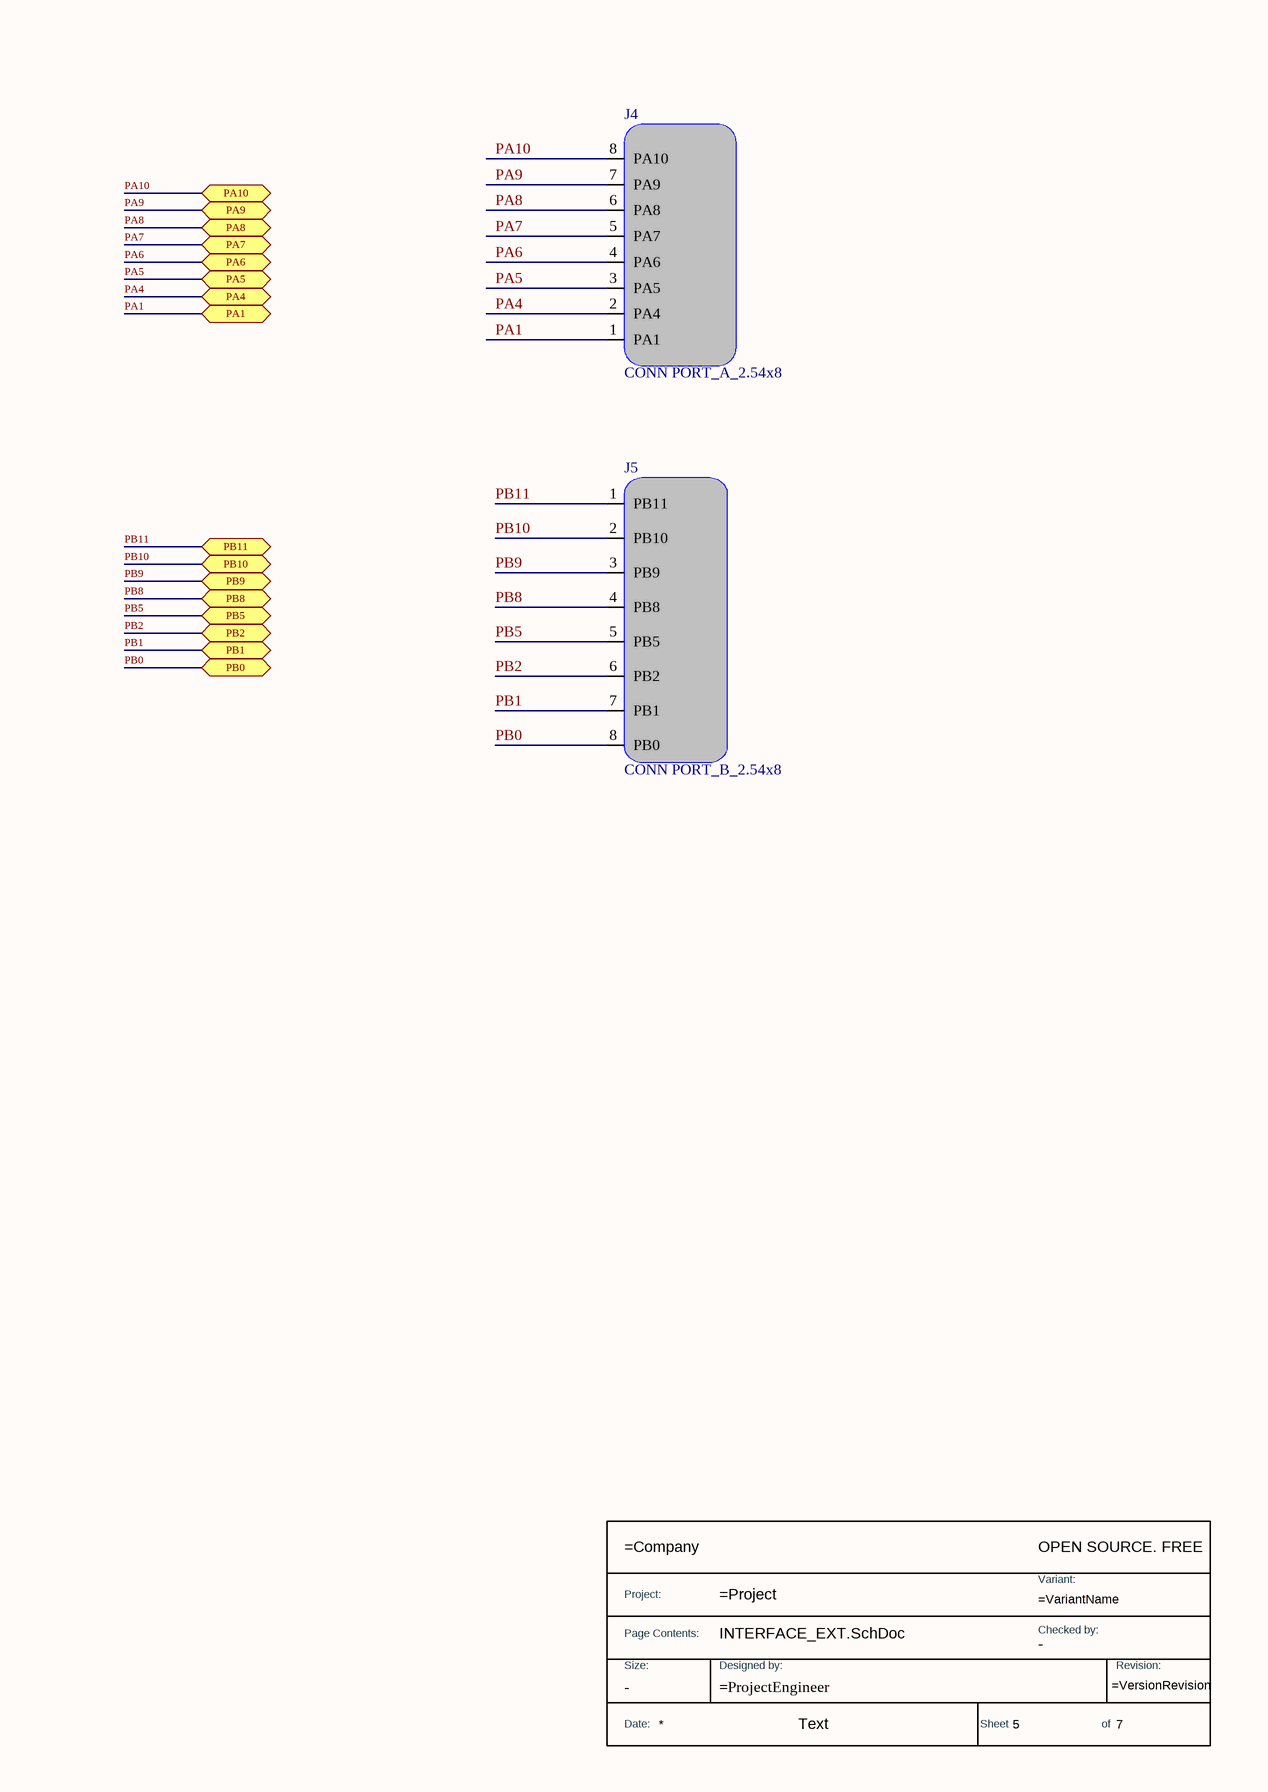
[diagram p9: INTERFACE_EXT.SchDoc, right]

### Parts
(Parts that share a designator on the sheet are numbered #1, #2 ... from top to bottom, then left to right.)
*#7  TitleBlock  (value not drawn)  (graphical)
J3  CONN_SWD  [CONN_5POS_2.54MM]
J4  CONN PORT_A_2.54x8  [CONN_HDR_2.54x16 - PA]
J5  CONN PORT_B_2.54x8  [CONN_HDR_2.54x16 - PB]
J6  HDR_2.54x6  [HDR_2.54x6]

### Ports
3V3 (out, see 1[6B], 3[8B], 4[1A], 6[1A], 7[1A]), NJTRST (bidir, see 1[6B], 6[8A]), NRST (bidir, see 1[6B], 6[8A]), PA1 (bidir, see 1[6C], 6[8C]), PA4 (bidir, see 1[6C], 6[8C]), PA5 (bidir, see 1[6C], 6[8C]), PA6 (bidir, see 1[6C], 6[8C]), PA7 (bidir, see 1[6C], 6[8C]), PA8 (bidir, see 1[6C], 6[8C]), PA9 (bidir, see 1[6C], 6[8C]), PA10 (bidir, see 1[6C], 6[8C]), PB0 (bidir, see 1[6C], 6[8C]), PB1 (bidir, see 1[6C], 6[8C]), PB2 (bidir, see 1[6C], 6[8C]), PB5 (bidir, see 1[6C], 6[8C]), PB8 (bidir, see 1[6C], 6[8C]), PB9 (bidir, see 1[6C], 6[8C]), PB10 (bidir, see 1[6C], 6[8C]), PB11 (bidir, see 1[6C], 6[8C]), SWCLK (bidir, see 1[6B], 6[8A]), SWDIO (bidir, see 1[6B], 6[8A]), UART_RX (bidir, see 1[6C], 6[8B]), UART_TX (bidir, see 1[6C], 6[8B]), USB_D_N (bidir, see 1[6C], 2[5C], 2[8B], 6[6B]), USB_D_P (bidir, see 1[6C], 2[5C], 2[8B], 6[6B]), VDD (out, see 1[6B], 6[8A])

### Nets
3V3: J6.1(3V3) ; port 3V3
GND: J3.5(GND) J6.2(GND)
VDD: J3.1(VCC) ; port VDD
NJTRST: J3.4(NJTRST) ; port NJTRST
NRST: J3.6(NRST) ; port NRST
PA1: J4.1(PA1) ; port PA1
PA4: J4.2(PA4) ; port PA4
PA5: J4.3(PA5) ; port PA5
PA6: J4.4(PA6) ; port PA6
PA7: J4.5(PA7) ; port PA7
PA8: J4.6(PA8) ; port PA8
PA9: J4.7(PA9) ; port PA9
PA10: J4.8(PA10) ; port PA10
PB0: J5.8(PB0) ; port PB0
PB1: J5.7(PB1) ; port PB1
PB2: J5.6(PB2) ; port PB2
PB5: J5.5(PB5) ; port PB5
PB8: J5.4(PB8) ; port PB8
PB9: J5.3(PB9) ; port PB9
PB10: J5.2(PB10) ; port PB10
PB11: J5.1(PB11) ; port PB11
SWCLK: J3.3(SWCLK) ; port SWCLK
SWDIO: J3.2(SWDIO) ; port SWDIO
UART_RX: J6.3(UART_RX) ; port UART_RX
UART_TX: J6.4(UART_TX) ; port UART_TX
USB_D_N: J6.5(USB_DN) ; port USB_D_N
USB_D_P: J6.6(UDB_DP) ; port USB_D_P

### Notes on the sheet
- (near J3) Pinos  = Gravação STM32
  SWDIO, SWCLK, NRST, VCC, GND
- Pinos  = Interface de Debug
  USB e UART
- Todas as informações e detalhes técnicos deste documento são de inteira propriedade da empresa V2COM,
- não poderão ser copiados, reduzidos ou cedidos a terceiros sem prévia autorização por escrito da mesma.
- Salvo em (D/M/A):
- Página:
- de
- Nome do Projeto:
- https://v2com.com/
- Ed.:
- Responsável:
- Nome da página:
- Rev.:
- Projetista:
- Obs.:
- Revisor:
- Arquivo:
- -
- (in symbol TitleBlock) OPEN SOURCE. FREE; Project:; Variant:; Page Contents:; Checked by:; Size:; Designed by:; Revision:; Date:; Text; Sheet; of

### Library data of the parts
*#7 = TitleBlock: Standard Title Block; DWG NO: =ProjectEngineer; Size: -; Checked by: -
J4 = CONN PORT_A_2.54x8: CONN HDR FEMALE 2.54 x 8POS
J5 = CONN PORT_B_2.54x8: CONN HDR FEMALE 2.54 x 8POS
J6 = HDR_2.54x6: CONN HDR FEMALE 2.54x6

## Nets that join several sheets
3V3: STM32L412CBU6 (7 pins), ST1S40IDR (6 pins), CC1101RGPR (FB6.1 R14.1), LSM6DSOTR (FB5.1 R13.1), INTERFACE_EXT (J6.1)
GND: KH-TYPE-C-16P (6 pins), STM32L412CBU6 (21 pins), ST1S40IDR (9 pins), CC1101RGPR (16 pins), LSM6DSOTR (5 pins), INTERFACE_EXT (J3.5 J6.2)
VDD: STM32L412CBU6 (11 pins), INTERFACE_EXT (J3.1)
I2C_SCL: STM32L412CBU6 (R8.1 TP17.1 U2.42), LSM6DSOTR (U3.13)
I2C_SDA: STM32L412CBU6 (R7.1 TP16.1 U2.43), LSM6DSOTR (U3.14)
NJTRST: STM32L412CBU6 (C16.1 U2.40), INTERFACE_EXT (J3.4)
NRST: STM32L412CBU6 (C12.2 U2.7), INTERFACE_EXT (J3.6)
PA1: STM32L412CBU6 (U2.11), INTERFACE_EXT (J4.1)
PA4: STM32L412CBU6 (U2.14), INTERFACE_EXT (J4.2)
PA5: STM32L412CBU6 (U2.15), INTERFACE_EXT (J4.3)
PA6: STM32L412CBU6 (U2.16), INTERFACE_EXT (J4.4)
PA7: STM32L412CBU6 (U2.17), INTERFACE_EXT (J4.5)
PA8: STM32L412CBU6 (U2.29), INTERFACE_EXT (J4.6)
PA9: STM32L412CBU6 (U2.30), INTERFACE_EXT (J4.7)
PA10: STM32L412CBU6 (U2.31), INTERFACE_EXT (J4.8)
PB0: STM32L412CBU6 (U2.18), INTERFACE_EXT (J5.8)
PB1: STM32L412CBU6 (U2.19), INTERFACE_EXT (J5.7)
PB2: STM32L412CBU6 (U2.20), INTERFACE_EXT (J5.6)
PB5: STM32L412CBU6 (U2.41), INTERFACE_EXT (J5.5)
PB8: STM32L412CBU6 (U2.45), INTERFACE_EXT (J5.4)
PB9: STM32L412CBU6 (U2.46), INTERFACE_EXT (J5.3)
PB10: STM32L412CBU6 (U2.21), INTERFACE_EXT (J5.2)
PB11: STM32L412CBU6 (U2.22), INTERFACE_EXT (J5.1)
SPI2_MISO: STM32L412CBU6 (TP12.1 U2.27), CC1101RGPR (U4.20)
SPI2_MOSI: STM32L412CBU6 (TP11.1 U2.28), CC1101RGPR (U4.2)
SPI2_nSS: STM32L412CBU6 (TP14.1 U2.25), CC1101RGPR (U4.7)
SPI2_SCK: STM32L412CBU6 (TP13.1 U2.26), CC1101RGPR (U4.1)
SWCLK: STM32L412CBU6 (U2.37), INTERFACE_EXT (J3.3)
SWDIO: STM32L412CBU6 (U2.34), INTERFACE_EXT (J3.2)
UART_RX: STM32L412CBU6 (U2.13), INTERFACE_EXT (J6.3)
UART_TX: STM32L412CBU6 (U2.12), INTERFACE_EXT (J6.4)
USB_D_N: KH-TYPE-C-16P (J2.2 TP1.1), STM32L412CBU6 (U2.32), INTERFACE_EXT (J6.5)
USB_D_P: KH-TYPE-C-16P (J2.3 TP2.1), STM32L412CBU6 (U2.33), INTERFACE_EXT (J6.6)

## Assembly variants
Variant of OBDH_Ed02: not fitted R4 R5 R6 R10 R11 R14 R16